# EAGLE design powerattempt9wout (EAGLE 6.1)
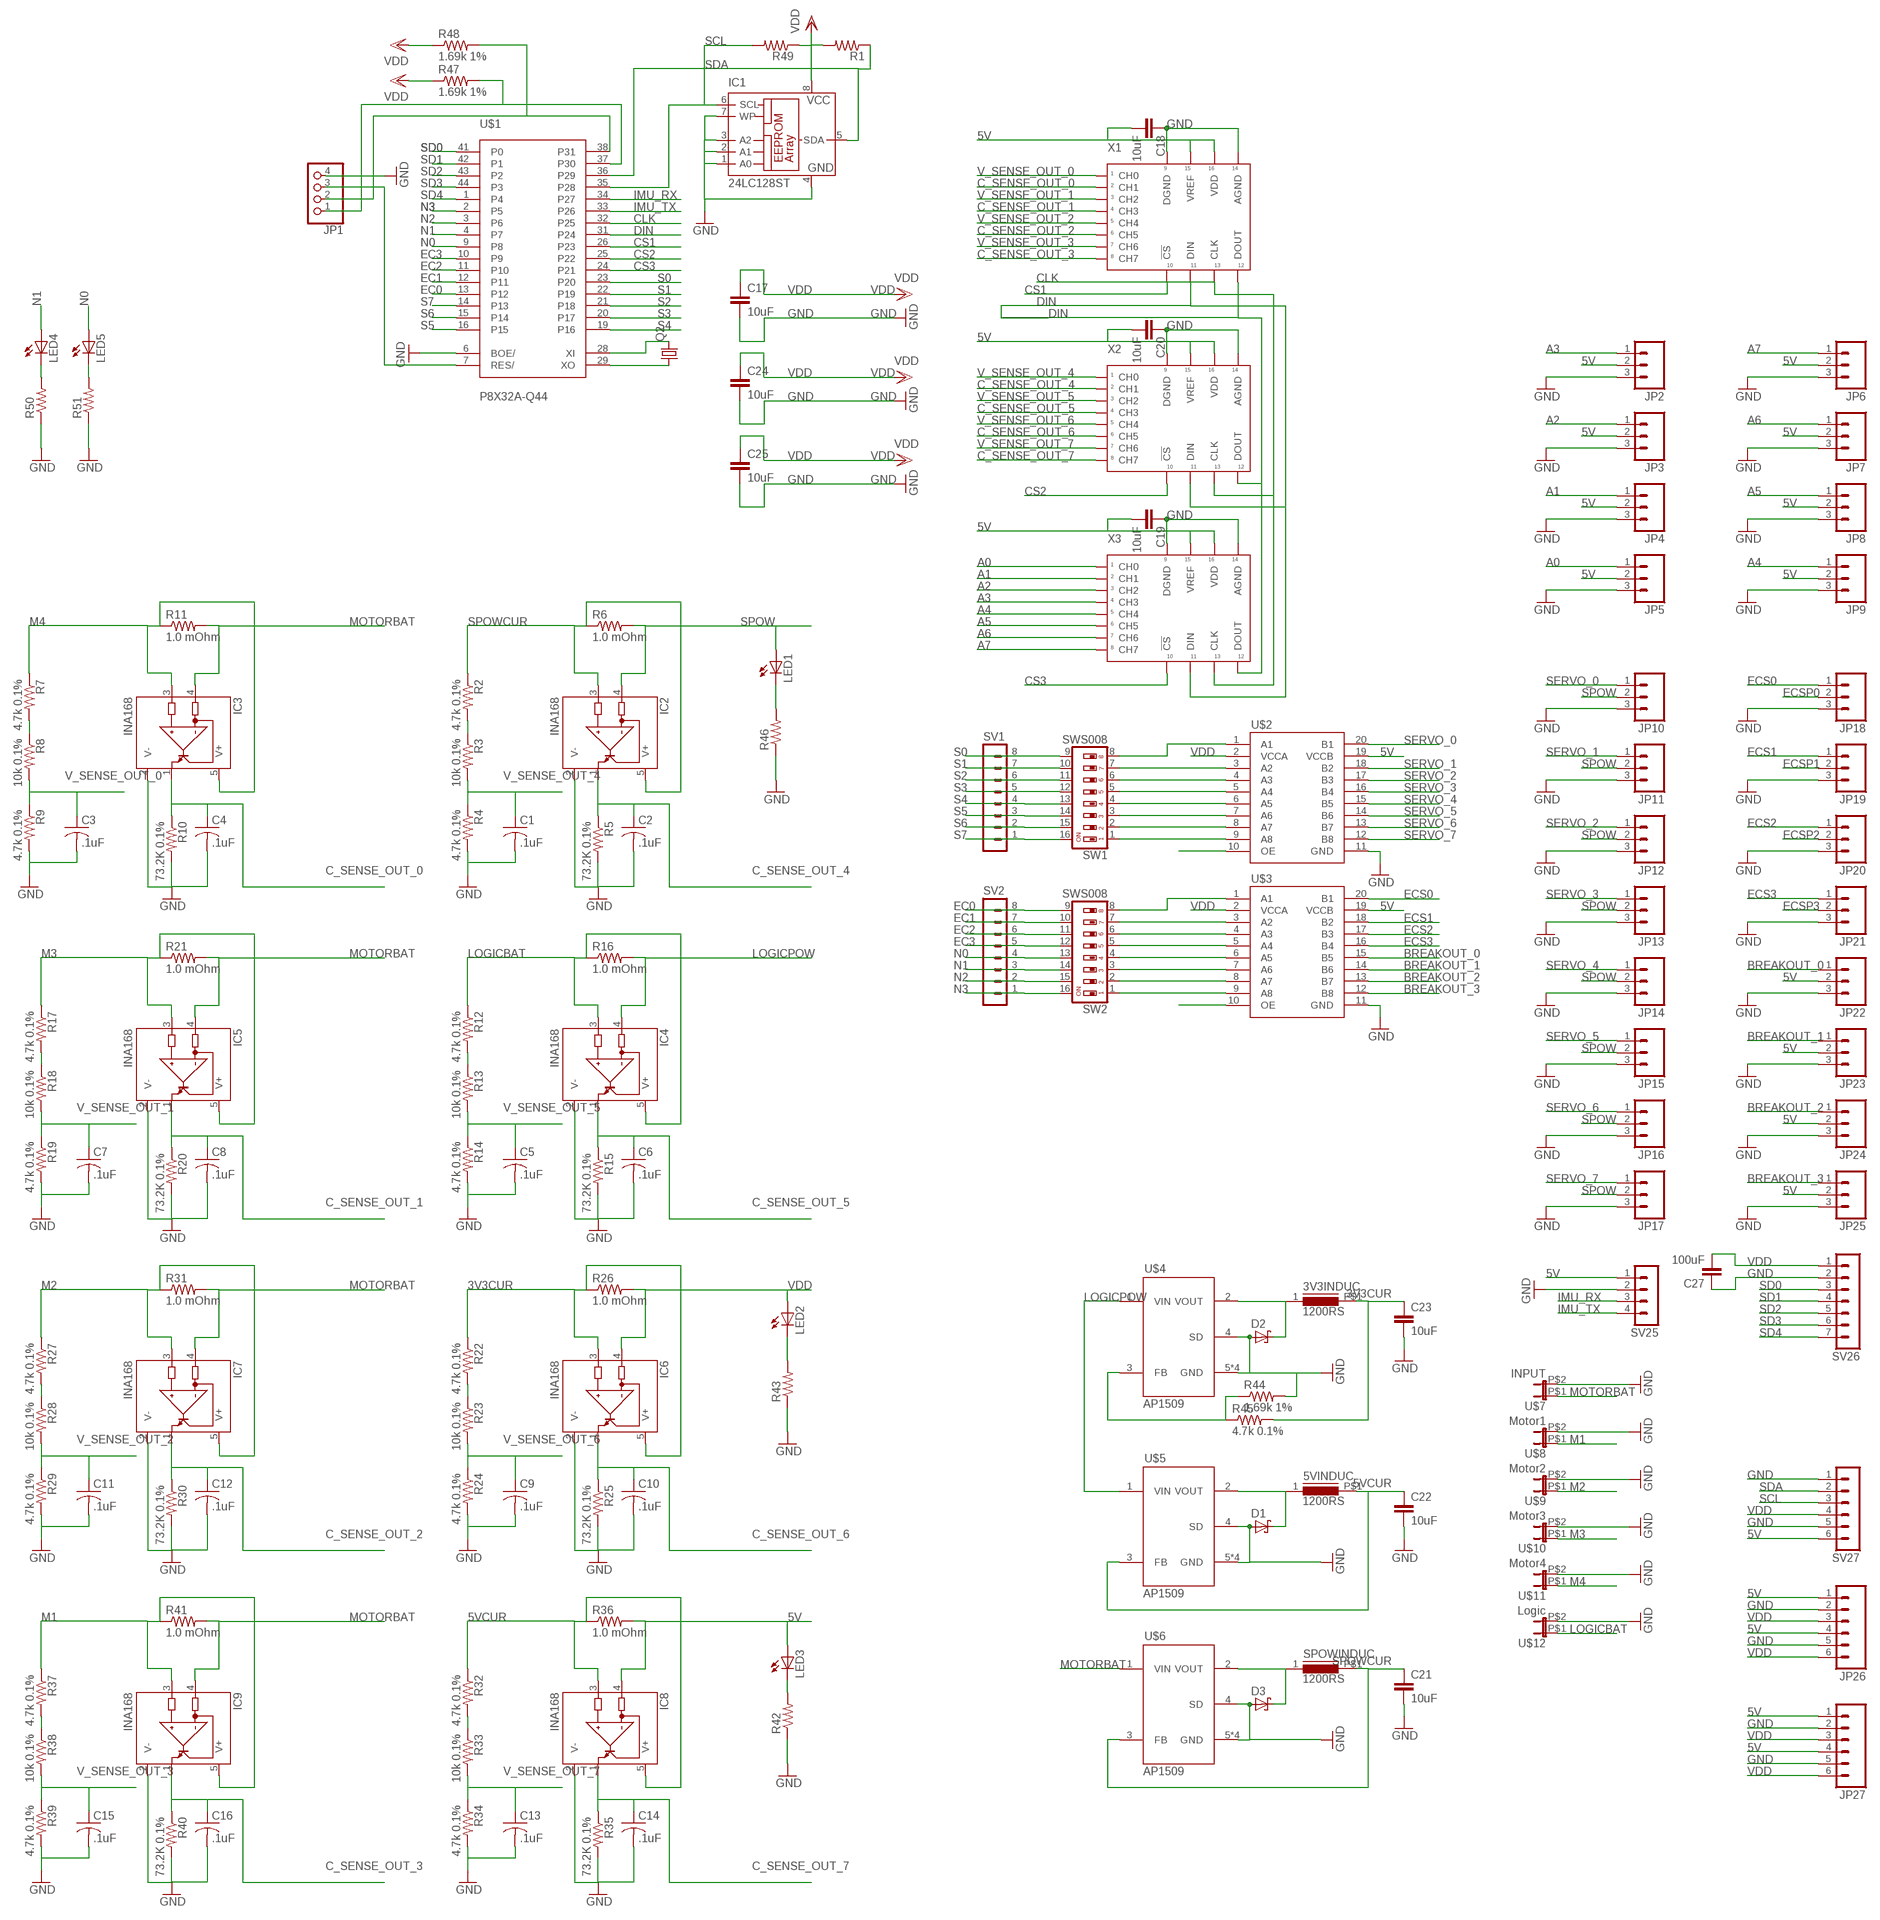
[diagram p0: schematic, sheet 1]

## Parts
3V3INDUC  1200RS  [1200RS]
5VINDUC  1200RS  [1200RS]
C1  .1uF  C-USC0805  [C0805]
C2  .1uF  C-USC0805  [C0805]
C3  .1uF  C-USC0805  [C0805]
C4  .1uF  C-USC0805  [C0805]
C5  .1uF  C-USC0805  [C0805]
C6  .1uF  C-USC0805  [C0805]
C7  .1uF  C-USC0805  [C0805]
C8  .1uF  C-USC0805  [C0805]
C9  .1uF  C-USC0805  [C0805]
C10  .1uF  C-USC0805  [C0805]
C11  .1uF  C-USC0805  [C0805]
C12  .1uF  C-USC0805  [C0805]
C13  .1uF  C-USC0805  [C0805]
C14  .1uF  C-USC0805  [C0805]
C15  .1uF  C-USC0805  [C0805]
C16  .1uF  C-USC0805  [C0805]
C17  10uF  CAP1206  [1206]
C18  10uF  CAP1206  [1206]
C19  10uF  CAP1206  [1206]
C20  10uF  CAP1206  [1206]
C21  10uF  CAP1206  [1206]
C22  10uF  CAP1206  [1206]
C23  10uF  CAP1206  [1206]
C24  10uF  CAP1206  [1206]
C25  10uF  CAP1206  [1206]
C27  100uF  CAP1206  [1206]
D1  SCHOTTKY-DIODESMD  [SMB]
D2  SCHOTTKY-DIODESMD  [SMB]
D3  SCHOTTKY-DIODESMD  [SMB]
IC1  24LC128ST  [TSSOP8]
IC2  INA168  [SOT23-5]
IC3  INA168  [SOT23-5]
IC4  INA168  [SOT23-5]
IC5  INA168  [SOT23-5]
IC6  INA168  [SOT23-5]
IC7  INA168  [SOT23-5]
IC8  INA168  [SOT23-5]
IC9  INA168  [SOT23-5]
JP1  PINHD-1X4/90  [1X04/90]
JP2  M03PTH  [1X03]
JP3  M03PTH  [1X03]
JP4  M03PTH  [1X03]
JP5  M03PTH  [1X03]
JP6  M03PTH  [1X03]
JP7  M03PTH  [1X03]
JP8  M03PTH  [1X03]
JP9  M03PTH  [1X03]
JP10  M03PTH  [1X03]
JP11  M03PTH  [1X03]
JP12  M03PTH  [1X03]
JP13  M03PTH  [1X03]
JP14  M03PTH  [1X03]
JP15  M03PTH  [1X03]
JP16  M03PTH  [1X03]
JP17  M03PTH  [1X03]
JP18  M03PTH  [1X03]
JP19  M03PTH  [1X03]
JP20  M03PTH  [1X03]
JP21  M03PTH  [1X03]
JP22  M03PTH  [1X03]
JP23  M03PTH  [1X03]
JP24  M03PTH  [1X03]
JP25  M03PTH  [1X03]
JP26  M06SIP  [1X06]
JP27  M06SIP  [1X06]
LED1  LEDSML0805  [SML0805]
LED2  LEDSML0805  [SML0805]
LED3  LEDSML0805  [SML0805]
LED4  LEDSML0805  [SML0805]
LED5  LEDSML0805  [SML0805]
Q2  CRYSTALHC49S  [HC49/S]
R1  R-US_M0805  [M0805]
R2  4.7k 0.1%  RESISTOR0805-RES  [0805]
R3  10k 0.1%  RESISTOR0805-RES  [0805]
R4  4.7k 0.1%  RESISTOR0805-RES  [0805]
R5  73.2K 0.1%  RESISTOR0805-RES  [0805]
R6  1.0 mOhm  LVK25  [LVK25]
R7  4.7k 0.1%  RESISTOR0805-RES  [0805]
R8  10k 0.1%  RESISTOR0805-RES  [0805]
R9  4.7k 0.1%  RESISTOR0805-RES  [0805]
R10  73.2K 0.1%  RESISTOR0805-RES  [0805]
R11  1.0 mOhm  LVK25  [LVK25]
R12  4.7k 0.1%  RESISTOR0805-RES  [0805]
R13  10k 0.1%  RESISTOR0805-RES  [0805]
R14  4.7k 0.1%  RESISTOR0805-RES  [0805]
R15  73.2K 0.1%  RESISTOR0805-RES  [0805]
R16  1.0 mOhm  LVK25  [LVK25]
R17  4.7k 0.1%  RESISTOR0805-RES  [0805]
R18  10k 0.1%  RESISTOR0805-RES  [0805]
R19  4.7k 0.1%  RESISTOR0805-RES  [0805]
R20  73.2K 0.1%  RESISTOR0805-RES  [0805]
R21  1.0 mOhm  LVK25  [LVK25]
R22  4.7k 0.1%  RESISTOR0805-RES  [0805]
R23  10k 0.1%  RESISTOR0805-RES  [0805]
R24  4.7k 0.1%  RESISTOR0805-RES  [0805]
R25  73.2K 0.1%  RESISTOR0805-RES  [0805]
R26  1.0 mOhm  LVK25  [LVK25]
R27  4.7k 0.1%  RESISTOR0805-RES  [0805]
R28  10k 0.1%  RESISTOR0805-RES  [0805]
R29  4.7k 0.1%  RESISTOR0805-RES  [0805]
R30  73.2K 0.1%  RESISTOR0805-RES  [0805]
R31  1.0 mOhm  LVK25  [LVK25]
R32  4.7k 0.1%  RESISTOR0805-RES  [0805]
R33  10k 0.1%  RESISTOR0805-RES  [0805]
R34  4.7k 0.1%  RESISTOR0805-RES  [0805]
R35  73.2K 0.1%  RESISTOR0805-RES  [0805]
R36  1.0 mOhm  LVK25  [LVK25]
R37  4.7k 0.1%  RESISTOR0805-RES  [0805]
R38  10k 0.1%  RESISTOR0805-RES  [0805]
R39  4.7k 0.1%  RESISTOR0805-RES  [0805]
R40  73.2K 0.1%  RESISTOR0805-RES  [0805]
R41  1.0 mOhm  LVK25  [LVK25]
R42  RESISTOR0805-RES  [0805]
R43  RESISTOR0805-RES  [0805]
R44  1.69k 1%  RESISTOR0805-RES  [0805]
R45  4.7k 0.1%  RESISTOR0805-RES  [0805]
R46  RESISTOR0805-RES  [0805]
R47  1.69k 1%  RESISTOR0805-RES  [0805]
R48  1.69k 1%  RESISTOR0805-RES  [0805]
R49  R-US_M0805  [M0805]
R50  RESISTOR0805-RES  [0805]
R51  RESISTOR0805-RES  [0805]
SPOWINDUC  1200RS  [1200RS]
SV1  MA08-1  [MA08-1]
SV2  MA08-1  [MA08-1]
SV25  MA04-1  [MA04-1]
SV26  MA07-1  [MA07-1]
SV27  MA06-1  [MA06-1]
SW1  SWS008  [SMS-008]
SW2  SWS008  [SMS-008]
U$1  P8X32A-Q44  [P8X32A-Q44]
U$2  TXB0108PWR  [TSSOP20]
U$3  TXB0108PWR  [TSSOP20]
U$4  AP1509  [SO08]
U$5  AP1509  [SO08]
U$6  AP1509  [SO08]
U$7  INPUT  DEANSDEANS  [DEANS]
U$8  Motor1  DEANSDEANS  [DEANS]
U$9  Motor2  DEANSDEANS  [DEANS]
U$10  Motor3  DEANSDEANS  [DEANS]
U$11  Motor4  DEANSDEANS  [DEANS]
U$12  Logic  DEANSDEANS  [DEANS]
X1  21298ESMD  [PDIP16]
X2  21298ESMD  [PDIP16]
X3  21298ESMD  [PDIP16]

## Nets
3V3CUR: 3V3INDUC.P$1 C23.1 IC6.3(IN+) IC6.5(V+) R22.1 R26.P$1 R45.2
5V: C18.2 C19.2 C20.2 IC8.4(IN-) JP2.2 JP3.2 JP4.2 JP5.2 JP6.2 JP7.2 JP8.2 JP9.2 JP22.2 JP23.2 JP24.2 JP25.2 JP26.1 JP26.4 JP27.1 JP27.4 LED3.A R36.P$5 SV25.1 SV27.6 U$2.19(VCCB) U$3.19(VCCB) X1.P$15(VREF) X1.P$16(VDD) X2.P$15(VREF) X2.P$16(VDD) X3.P$15(VREF) X3.P$16(VDD)
5VCUR: 5VINDUC.P$1 C22.1 IC8.3(IN+) IC8.5(V+) R32.1 R36.P$1 U$5.3(FB)
A0: JP5.1 X3.P$1(CH0)
A1: JP4.1 X3.P$2(CH1)
A2: JP3.1 X3.P$3(CH2)
A3: JP2.1 X3.P$4(CH3)
A4: JP9.1 X3.P$5(CH4)
A5: JP8.1 X3.P$6(CH5)
A6: JP7.1 X3.P$7(CH6)
A7: JP6.1 X3.P$8(CH7)
BREAKOUT_0: JP22.1 U$3.15(B5)
BREAKOUT_1: JP23.1 U$3.14(B6)
BREAKOUT_2: JP24.1 U$3.13(B7)
BREAKOUT_3: JP25.1 U$3.12(B8)
C_SENSE_OUT_0: C4.1 IC3.1(OUT) R10.1 X1.P$2(CH1)
C_SENSE_OUT_1: C8.1 IC5.1(OUT) R20.1 X1.P$4(CH3)
C_SENSE_OUT_2: C12.1 IC7.1(OUT) R30.1 X1.P$6(CH5)
C_SENSE_OUT_3: C16.1 IC9.1(OUT) R40.1 X1.P$8(CH7)
C_SENSE_OUT_4: C2.1 IC2.1(OUT) R5.1 X2.P$2(CH1)
C_SENSE_OUT_5: C6.1 IC4.1(OUT) R15.1 X2.P$4(CH3)
C_SENSE_OUT_6: C10.1 IC6.1(OUT) R25.1 X2.P$6(CH5)
C_SENSE_OUT_7: C14.1 IC8.1(OUT) R35.1 X2.P$8(CH7)
CLK: U$1.32(P25) X1.P$13(CLK) X2.P$13(CLK) X3.P$13(CLK)
CS1: U$1.26(P23) X1.P$10(!CS)
CS2: U$1.25(P22) X2.P$10(!CS)
CS3: U$1.24(P21) X3.P$10(!CS)
DIN: U$1.31(P24) X1.P$11(DIN) X1.P$12(DOUT) X2.P$11(DIN) X2.P$12(DOUT) X3.P$11(DIN) X3.P$12(DOUT)
EC0: SV2.8 SW2.9 U$1.13(P12)
EC1: SV2.7 SW2.10 U$1.12(P11)
EC2: SV2.6 SW2.11 U$1.11(P10)
EC3: SV2.5 SW2.12 U$1.10(P9)
ECS0: JP18.1 U$3.20(B1)
ECS1: JP19.1 U$3.18(B2)
ECS2: JP20.1 U$3.17(B3)
ECS3: JP21.1 U$3.16(B4)
ECSP0: JP18.2
ECSP1: JP19.2
ECSP2: JP20.2
ECSP3: JP21.2
GND: C1.2 C2.2 C3.2 C4.2 C5.2 C6.2 C7.2 C8.2 C9.2 C10.2 C11.2 C12.2 C13.2 C14.2 C15.2 C16.2 C17.2 C18.1 C19.1 C20.1 C21.2 C22.2 C23.2 C24.2 C25.2 C27.1 D1.A D2.A D3.A IC1.1(A0) IC1.2(A1) IC1.3(A2) IC1.4(GND) IC1.7(WP) IC2.2(V-) IC3.2(V-) IC4.2(V-) IC5.2(V-) IC6.2(V-) IC7.2(V-) IC8.2(V-) IC9.2(V-) JP1.4 JP2.3 JP3.3 JP4.3 JP5.3 JP6.3 JP7.3 JP8.3 JP9.3 JP10.3 JP11.3 JP12.3 JP13.3 JP14.3 JP15.3 JP16.3 JP17.3 JP18.3 JP19.3 JP20.3 JP21.3 JP22.3 JP23.3 JP24.3 JP25.3 JP26.2 JP26.5 JP27.2 JP27.5 R4.2 R5.2 R9.2 R10.2 R14.2 R15.2 R19.2 R20.2 R24.2 R25.2 R29.2 R30.2 R34.2 R35.2 R39.2 R40.2 R42.1 R43.1 R44.2 R46.1 R50.1 R51.1 SV25.2 SV26.2 SV27.1 SV27.5 U$1.6(BOE/) U$2.11(GND) U$3.11(GND) U$4.4(SD) U$4.5(GND) U$4.6(GND) U$4.7(GND) U$4.8(GND) U$5.4(SD) U$5.5(GND) U$5.6(GND) U$5.7(GND) U$5.8(GND) U$6.4(SD) U$6.5(GND) U$6.6(GND) U$6.7(GND) U$6.8(GND) U$7.P$2 U$8.P$2 U$9.P$2 U$10.P$2 U$11.P$2 U$12.P$2 X1.P$9(DGND) X1.P$14(AGND) X2.P$9(DGND) X2.P$14(AGND) X3.P$9(DGND) X3.P$14(AGND)
IMU_RX: SV25.3 U$1.34(P27)
IMU_TX: SV25.4 U$1.33(P26)
LOGICBAT: IC4.3(IN+) IC4.5(V+) R12.1 R16.P$1 U$12.P$1
LOGICPOW: IC4.4(IN-) R16.P$5 U$4.1(VIN) U$5.1(VIN)
M1: IC9.3(IN+) IC9.5(V+) R37.1 R41.P$1 U$8.P$1
M2: IC7.3(IN+) IC7.5(V+) R27.1 R31.P$1 U$9.P$1
M3: IC5.3(IN+) IC5.5(V+) R17.1 R21.P$1 U$10.P$1
M4: IC3.3(IN+) IC3.5(V+) R7.1 R11.P$1 U$11.P$1
MOTORBAT: IC3.4(IN-) IC5.4(IN-) IC7.4(IN-) IC9.4(IN-) R11.P$5 R21.P$5 R31.P$5 R41.P$5 U$6.1(VIN) U$7.P$1
N0: LED5.A SV2.4 SW2.13 U$1.9(P8)
N1: LED4.A SV2.3 SW2.14 U$1.4(P7)
N2: SV2.2 SW2.15 U$1.3(P6)
N3: SV2.1 SW2.16 U$1.2(P5)
N$1: JP1.1 R47.2 U$1.37(P30)
N$2: JP1.2 R48.2 U$1.38(P31)
N$3: LED4.C R50.2
N$4: LED5.C R51.2
N$5: Q2.1 U$1.29(XO)
N$6: Q2.2 U$1.28(XI)
N$7: JP1.3 U$1.7(RES/)
N$12: R2.2 R3.1
N$13: R7.2 R8.1
N$16: R12.2 R13.1
N$19: R17.2 R18.1
N$22: R22.2 R23.1
N$25: R27.2 R28.1
N$28: R32.2 R33.1
N$31: R37.2 R38.1
N$32: SW1.8 U$2.1(A1)
N$33: SW1.7 U$2.3(A2)
N$34: SW1.6 U$2.4(A3)
N$35: SW1.5 U$2.5(A4)
N$36: SW1.4 U$2.6(A5)
N$37: SW1.3 U$2.7(A6)
N$38: SW1.2 U$2.8(A7)
N$39: SW1.1 U$2.9(A8)
N$40: U$2.10(OE)
N$41: SW2.8 U$3.1(A1)
N$42: SW2.7 U$3.3(A2)
N$43: SW2.6 U$3.4(A3)
N$44: SW2.5 U$3.5(A4)
N$45: SW2.4 U$3.6(A5)
N$46: SW2.3 U$3.7(A6)
N$47: SW2.2 U$3.8(A7)
N$48: SW2.1 U$3.9(A8)
N$49: U$3.10(OE)
N$71: LED1.C R46.2
N$72: LED2.C R43.2
N$73: LED3.C R42.2
N$77: 3V3INDUC.1 D2.C U$4.2(VOUT)
N$78: 5VINDUC.1 D1.C U$5.2(VOUT)
N$79: D3.C SPOWINDUC.1 U$6.2(VOUT)
N$83: R44.1 R45.1 U$4.3(FB)
S0: SV1.8 SW1.9 U$1.23(P20)
S1: SV1.7 SW1.10 U$1.22(P19)
S2: SV1.6 SW1.11 U$1.21(P18)
S3: SV1.5 SW1.12 U$1.20(P17)
S4: SV1.4 SW1.13 U$1.19(P16)
S5: SV1.3 SW1.14 U$1.16(P15)
S6: SV1.2 SW1.15 U$1.15(P14)
S7: SV1.1 SW1.16 U$1.14(P13)
SCL: IC1.6(SCL) R49.2 SV27.3 U$1.35(P28)
SD0: SV26.3 U$1.41(P0)
SD1: SV26.4 U$1.42(P1)
SD2: SV26.5 U$1.43(P2)
SD3: SV26.6 U$1.44(P3)
SD4: SV26.7 U$1.1(P4)
SDA: IC1.5(SDA) R1.1 SV27.2 U$1.36(P29)
SERVO_0: JP10.1 U$2.20(B1)
SERVO_1: JP11.1 U$2.18(B2)
SERVO_2: JP12.1 U$2.17(B3)
SERVO_3: JP13.1 U$2.16(B4)
SERVO_4: JP14.1 U$2.15(B5)
SERVO_5: JP15.1 U$2.14(B6)
SERVO_6: JP16.1 U$2.13(B7)
SERVO_7: JP17.1 U$2.12(B8)
SPOW: IC2.4(IN-) JP10.2 JP11.2 JP12.2 JP13.2 JP14.2 JP15.2 JP16.2 JP17.2 LED1.A R6.P$5
SPOWCUR: C21.1 IC2.3(IN+) IC2.5(V+) R2.1 R6.P$1 SPOWINDUC.P$1 U$6.3(FB)
V_SENSE_OUT_0: C3.1 R8.2 R9.1 X1.P$1(CH0)
V_SENSE_OUT_1: C7.1 R18.2 R19.1 X1.P$3(CH2)
V_SENSE_OUT_2: C11.1 R28.2 R29.1 X1.P$5(CH4)
V_SENSE_OUT_3: C15.1 R38.2 R39.1 X1.P$7(CH6)
V_SENSE_OUT_4: C1.1 R3.2 R4.1 X2.P$1(CH0)
V_SENSE_OUT_5: C5.1 R13.2 R14.1 X2.P$3(CH2)
V_SENSE_OUT_6: C9.1 R23.2 R24.1 X2.P$5(CH4)
V_SENSE_OUT_7: C13.1 R33.2 R34.1 X2.P$7(CH6)
VDD: C17.1 C24.1 C25.1 C27.2 IC1.8(VCC) IC6.4(IN-) JP26.3 JP26.6 JP27.3 JP27.6 LED2.A R1.2 R26.P$5 R47.1 R48.1 R49.1 SV26.1 SV27.4 U$2.2(VCCA) U$3.2(VCCA)

## Power pins joined to a net without a drawn wire
GND: U$1.5(GND) U$1.17(GND) U$1.27(GND) U$1.39(GND)
VDD: U$1.8(VDD) U$1.18(VDD) U$1.30(VDD) U$1.40(VDD)

## Library data of the parts
3V3INDUC 5VINDUC SPOWINDUC = inductors:1200RS
C1-C16 = resistor:C-US: CAPACITOR, American symbol
C17-C25 C27 = SparkFun:CAP: Capacitor Standard 0603 ceramic capacitor, and 0.1" leaded capacitor.
D1-D3 = diode:SCHOTTKY-DIODE: Schottky Diode
IC1 = microchip:24*: Serial EEPROM I2C; MF: MICROCHIP; MPN: 24LC128-I/ST; OC_FARNELL: 1296573; OC_NEWARK: 62K0578
IC2-IC9 = burr-brown:INA168: High-Side Measurement Current Shunt Monitor; MF: TEXAS INSTRUMENTS; MPN: INA168NA/250; OC_FARNELL: 4375737; OC_NEWARK: 35C1744
JP1 = pinhead:PINHD-1X4: PIN HEADER
JP2-JP25 = SparkFun:M03: Header 3 Standard 3-pin 0.1" header. Use with straight break away headers (SKU : PRT-00116), right angle break away headers (PRT-00553), swiss pins (PRT-00743), machine pins (PRT-00117), and female headers (PRT-00115). Molex polarized connector foot print use with SKU : PRT-08232 with associated crimp pins and housings.
JP26 JP27 = SparkFun:M06: Header 6 Standard 6-pin 0.1" header. Use with straight break away headers (SKU : PRT-00116), right angle break away headers (PRT-00553), swiss pins (PRT-00743), machine pins (PRT-00117), and female headers (PRT-00115). Molex polarized connector foot print use with SKU : PRT-08094 with associated crimp pins and housings. NOTES ON THE VARIANTS LOCK and LOCK_LONGPADS... This footprint was designed to help hold the alignment of a through-hole component (i.e. 6-pin header) while soldering it into place. You may notice that each hole has been shifted either up or down by 0.005 of an inch from it's more standard position (which is a perfectly straight line). This slight alteration caused the pins (the squares in the middle) to touch the edges of the holes. Because they are alternating, it causes a "brace" to hold the component in place. 0.005 has proven to be the perfect amount of "off-center" position when using our standard breakaway headers. Although looks a little odd when you look at the bare footprint, once you have a header in there, the alteration is very hard to notice. Also, if you push a header all the way into place, it is covered up entirely on the bottom side. This idea of altering the position of holes to aid alignment will be further integrated into the Sparkfun Library for other footprints. It can help hold any component with 3 or more connection pins.
LED1-LED5 = led:LED: LED OSRAM: - CHIPLED LG R971, LG N971, LY N971, LG Q971, LY Q971, LO R971, LY R971 LH N974, LH R974 LS Q976, LO Q976, LY Q976 LO Q996 - Hyper CHIPLED LW Q18S LB Q993, LB Q99A, LB R99A - SideLED LS A670, LO A670, LY A670, LG A670, LP A670 LB A673, LV A673, LT A673, LW A673 LH A674 LY A675 LS A676, LA A676, LO A676, LY A676, LW A676 LS A679, LY A679, LG A679 - Hyper Micro SIDELED® LS Y876, LA Y876, LO Y876, LY Y876 LT Y87S - SmartLED LW L88C, LW L88S LB L89C, LB L89S, LG L890 LS L89K, LO L89K, LY L89K LS L896, LA L896, LO L896, LY L896 - TOPLED LS T670, LO T670, LY T670, LG T670, LP T670 LSG T670, LSP T670, LSY T670, LOP T670, LYG T670 LG T671, LOG T671, LSG T671 LB T673, LV T673, LT T673, LW T673 LH T674 LS T676, LA T676, LO T676, LY T676, LB T676, LH T676, LSB T676, LW T676 LB T67C, LV T67C, LT T67C, LS T67K, LO T67K, LY T67K, LW E67C LS E67B, LA E67B, LO E67B, LY E67B, LB E67C, LV E67C, LT E67C LW T67C LS T679, LY T679, LG T679 LS T770, LO T770, LY T770, LG T770, LP T770 LB T773, LV T773, LT T773, LW T773 LH T774 LS E675, LA E675, LY E675, LS T675 LS T776, LA T776, LO T776, LY T776, LB T776 LHGB T686 LT T68C, LB T68C - Hyper Mini TOPLED® LB M676 - Mini TOPLED Santana® LG M470 LS M47K, LO M47K, LY M47K Source: http://www.osram.convergy.de LUXEON: - LUMILED® LXK2-PW12-R00, LXK2-PW12-S00, LXK2-PW14-U00, LXK2-PW14-V00 LXK2-PM12-R00, LXK2-PM12-S00, LXK2-PM14-U00 LXK2-PE12-Q00, LXK2-PE12-R00, LXK2-PE12-S00, LXK2-PE14-T00, LXK2-PE14-U00 LXK2-PB12-K00, LXK2-PB12-L00, LXK2-PB12-M00, LXK2-PB14-N00, LXK2-PB14-P00, LXK2-PB14-Q00 LXK2-PR12-L00, LXK2-PR12-M00, LXK2-PR14-Q00, LXK2-PR14-R00 LXK2-PD12-Q00, LXK2-PD12-R00, LXK2-PD12-S00 LXK2-PH12-R00, LXK2-PH12-S00 LXK2-PL12-P00, LXK2-PL12-Q00, LXK2-PL12-R00 Source: www.luxeon.com KINGBRIGHT: KA-3528ASYC Source: www.kingbright.com
Q2 = crystal:CRYSTAL: CRYSTAL; OC_FARNELL: 1667008; OC_NEWARK: unknown
R1 R49 = resistor:R-US_: RESISTOR, American symbol
R2-R5 R7-R10 R12-R15 R17-R20 R22-R25 R27-R30 R32-R35 R37-R40 R42-R48 R50 R51 = SparkFun:RESISTOR: Resistor Basic schematic elements and footprints for 0603, 1206, and PTH resistors.
R6 R11 R16 R21 R26 R31 R36 R41 = SparkFun:LVK25
SV1 SV2 = con-lstb:MA08-1: PIN HEADER; OC_FARNELL: unknown; OC_NEWARK: unknown
SV25 = con-lstb:MA04-1: PIN HEADER; OC_FARNELL: unknown; OC_NEWARK: unknown
SV26 = con-lstb:MA07-1: PIN HEADER; OC_FARNELL: unknown; OC_NEWARK: unknown
SV27 = con-lstb:MA06-1: PIN HEADER; OC_FARNELL: unknown; OC_NEWARK: unknown
SW1 SW2 = smd-special:SWS008: SMD Dip Switch 8 pol.
U$1 = parallax_propeller:P8X32A-Q44
U$2 U$3 = SparkFun:TXB0108PWR: Logic level shifter. TSSOP20
U$4-U$6 = SparkFun:AP1509
U$7-U$12 = SparkFun:DEANS
X1-X3 = Microchip (2):21298E

## Board
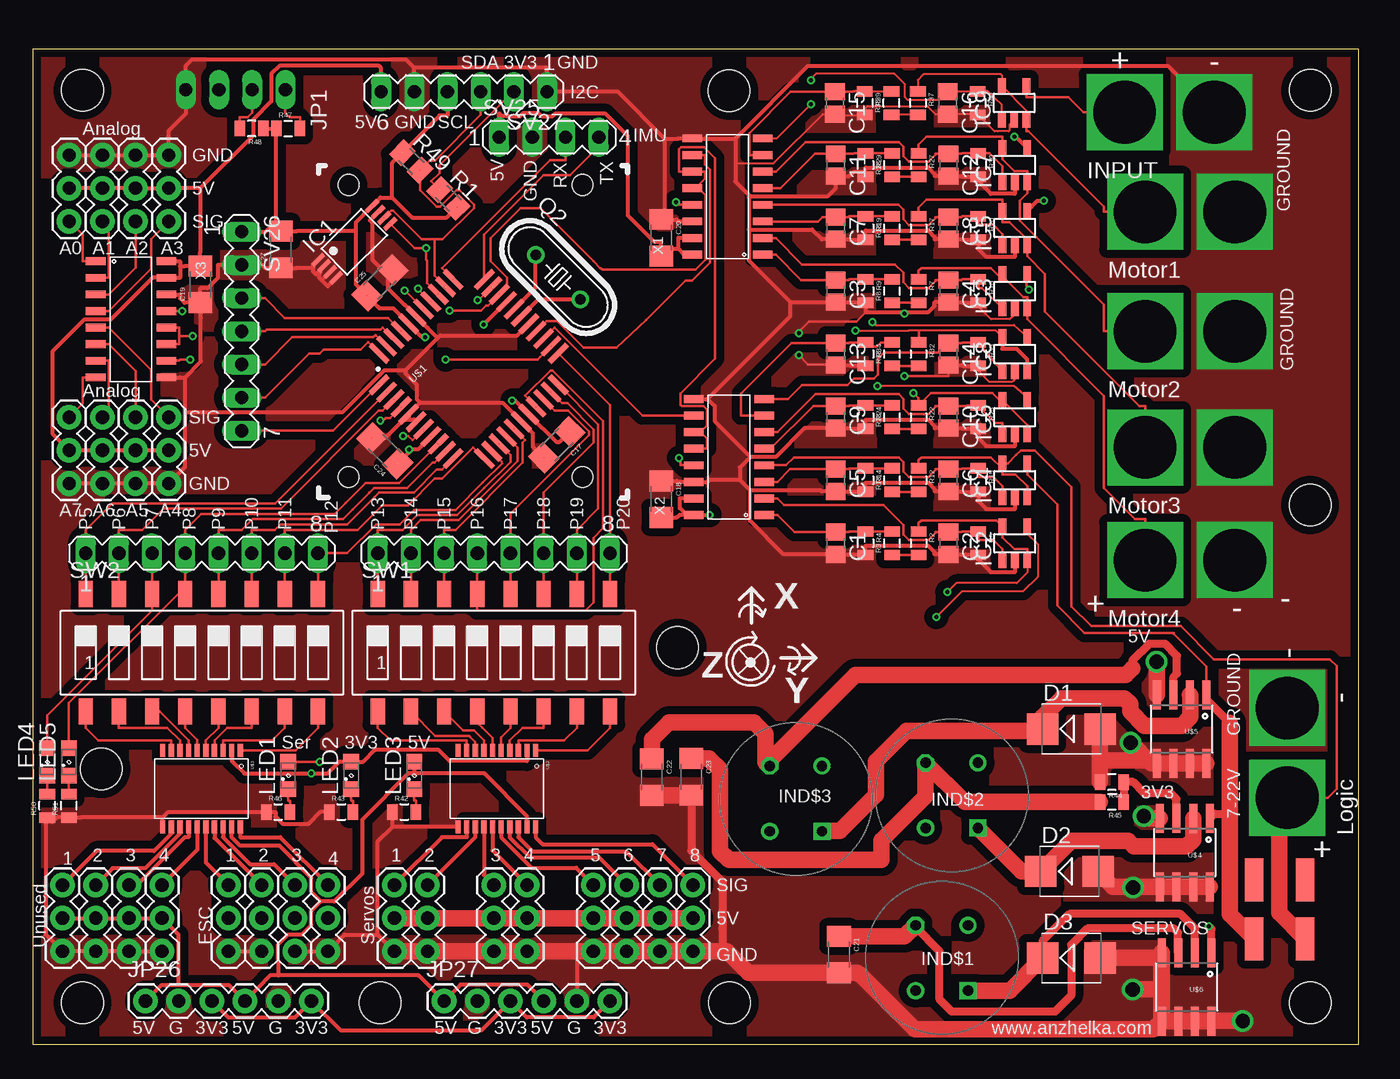
[diagram p1: board, top side]
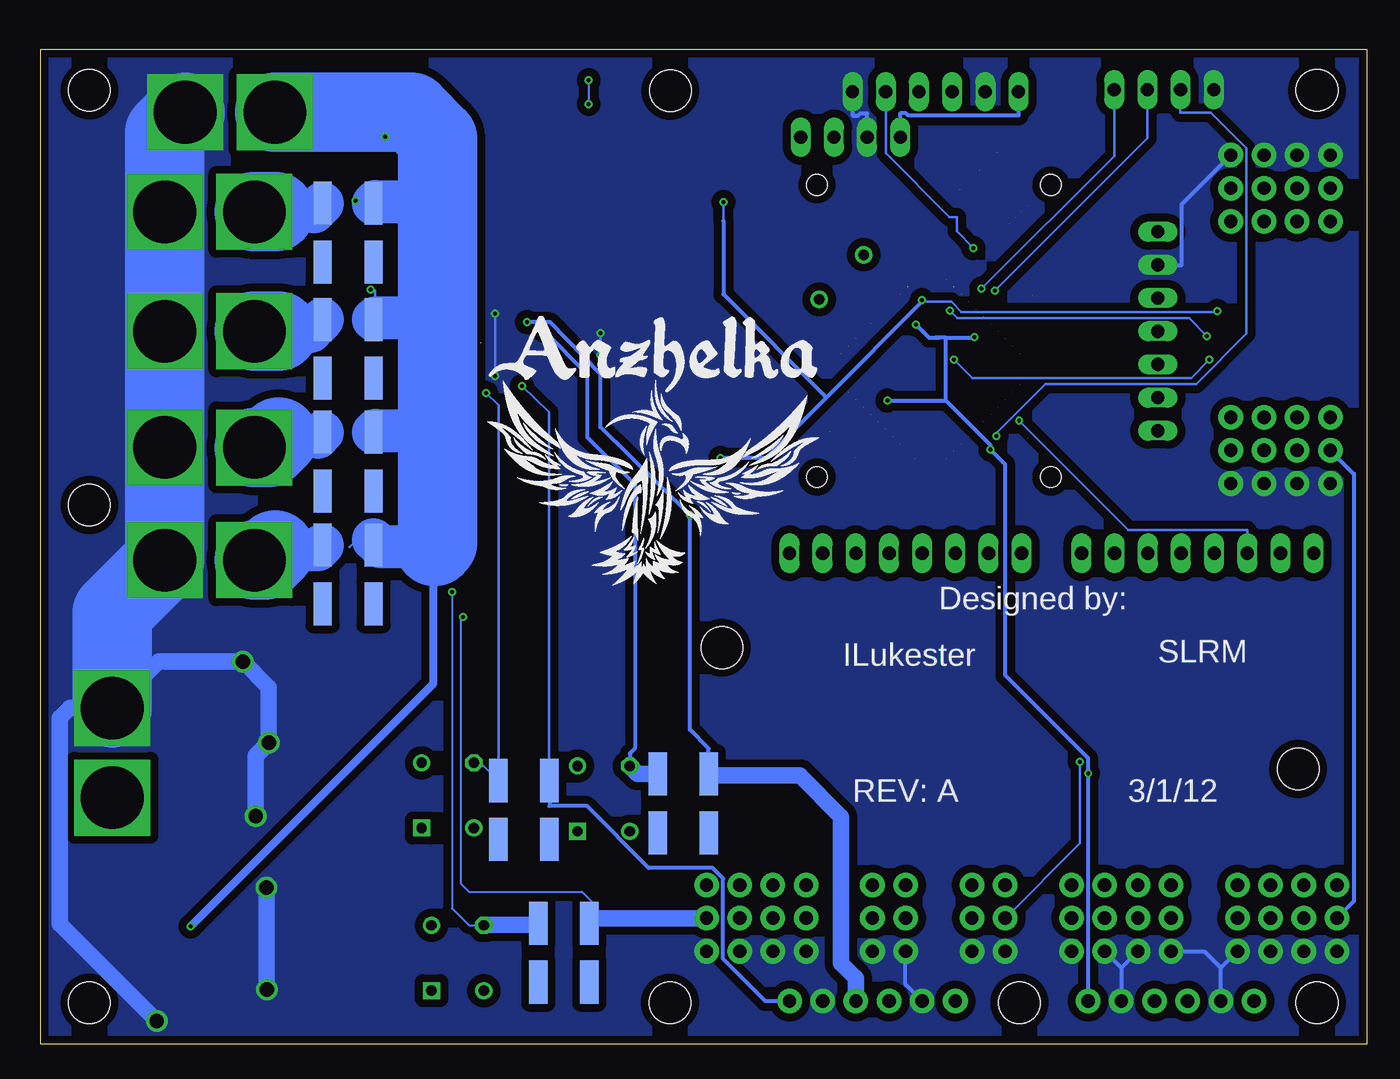
[diagram p2: board, bottom side, seen from below]

Size 101.52 x 76.19 mm. Coordinates in mm from the lower left corner, seen from the top.
Outline: 0,0 101.52,0 101.52,76.19 0,76.19 0,0
Copper layers (1*16): Top 0.035mm / dielectric 1.5mm / Bottom 0.035mm
Design rules: minimum track width 6mil, minimum drill 12mil, track to track 6mil, track to pad 6mil, pad to pad 6mil, via to via 6mil, smd to smd 0mil, copper to edge 10mil, drill to drill 10mil, minimum pad ring 10mil, minimum via ring 6mil, stop-mask expansion 2mil, vias tented up to drill 100mil, thermal gap 10mil
Holes 1.6 mm at 24.19,43.43 24.19,65.79 42.09,43.43 42.09,65.79
Holes 3.2 mm at 3.81,73.03 97.79,73.03 97.79,3.17 3.81,3.17 53.34,3.17 53.31,73 26.59,3.17 5.26,21.08 49.38,30.35 97.79,41.27

### Footprints (pad centres in the part's own frame; a part is rotated, then mirrored left to right if it is on the bottom)
1200RS = drill 0.8 square: 1 -2,2.5 | drill 0.8: 2 -2,-2.5; 4 2,2.5 | drill 0.8 octagon: P$1 2,-2.5
C0805 = smd 1.3 x 1.5: 1 -0.85,0; 2 0.85,0
1206 = smd 1.6 x 1.8: 1 -1.4,0; 2 1.4,0
SMB = smd 2.4 x 2.4: A 2.2,0; C -2.2,0
TSSOP8 = smd 0.35 x 1.2: 1 -0.975,-2.925; 2 -0.325,-2.925; 3 0.325,-2.925; 4 0.975,-2.925; 5 0.975,2.925; 6 0.325,2.925; 7 -0.325,2.925; 8 -0.975,2.925
SOT23-5 = smd 0.6 x 1.2: 1 -0.95,-1.306; 2 0,-1.306; 3 0.95,-1.306; 4 0.95,1.306; 5 -0.95,1.306
1X04/90 = drill 1.016 long: 1 -3.81,-3.81; 2 -1.27,-3.81; 3 1.27,-3.81; 4 3.81,-3.81
1X03 = drill 1.016 pad 1.88: 1 0,0; 2 2.54,0; 3 5.08,0
1X06 = drill 1.016 pad 1.88: 1 0,0; 2 2.54,0; 3 5.08,0; 4 7.62,0; 5 10.16,0; 6 12.7,0
SML0805 = smd 1.2 x 1.2: A 1.05,0; C -1.05,0
HC49/S = drill 0.813: 1 -2.413,0; 2 2.413,0
M0805 = smd 1.3 x 1.6: 1 -0.95,0; 2 0.95,0
0805 = smd 0.8 x 1.2: 1 -0.9,0; 2 0.9,0
LVK25 = smd 1.4 x 3.3: P$1 -1.96,2.15; P$5 1.94,2.15; P$10 1.94,-2.35; P$11 -1.96,-2.35
MA08-1 = drill 1.016 long: 1 -8.89,0; 2 -6.35,0; 3 -3.81,0; 4 -1.27,0; 5 1.27,0; 6 3.81,0; 7 6.35,0; 8 8.89,0
MA04-1 = drill 1.016 long: 1 -3.81,0; 2 -1.27,0; 3 1.27,0; 4 3.81,0
MA07-1 = drill 1.016 long: 1 -7.62,0; 2 -5.08,0; 3 -2.54,0; 4 0,0; 5 2.54,0; 6 5.08,0; 7 7.62,0
MA06-1 = drill 1.016 long: 1 -6.35,0; 2 -3.81,0; 3 -1.27,0; 4 1.27,0; 5 3.81,0; 6 6.35,0
SMS-008 = smd 1.092 x 2.007: 1 -8.89,-4.496; 2 -6.35,-4.496; 3 -3.81,-4.496; 4 -1.27,-4.496; 5 1.27,-4.496; 6 3.81,-4.496; 7 6.35,-4.496; 8 8.89,-4.496; 9 8.89,4.496; 10 6.35,4.496; 11 3.81,4.496; 12 1.27,4.496; 13 -1.27,4.496; 14 -3.81,4.496; 15 -6.35,4.496; 16 -8.89,4.496
P8X32A-Q44 = smd 1.9 x 0.4: 1 -5.713,4.013; 2 -5.713,3.212; 3 -5.713,2.413; 4 -5.713,1.613; 5 -5.713,0.812; 6 -5.713,0.013; 7 -5.713,-0.787; 8 -5.713,-1.587; 9 -5.713,-2.388; 10 -5.713,-3.188; 11 -5.713,-3.987; 23 5.688,-3.987; 24 5.688,-3.188; 25 5.688,-2.388; 26 5.688,-1.587; 27 5.688,-0.787; 28 5.688,0.013; 29 5.688,0.812; 30 5.688,1.613; 31 5.688,2.413; 32 5.688,3.212; 33 5.688,4.013 | smd 0.4 x 1.9: 12 -4.013,-5.688; 13 -3.212,-5.688; 14 -2.413,-5.688; 15 -1.613,-5.688; 16 -0.812,-5.688; 17 -0.013,-5.688; 18 0.787,-5.688; 19 1.587,-5.688; 20 2.388,-5.688; 21 3.188,-5.688; 22 3.987,-5.688; 34 3.987,5.713; 35 3.188,5.713; 36 2.388,5.713; 37 1.587,5.713; 38 0.787,5.713; 39 -0.013,5.713; 40 -0.812,5.713; 41 -1.613,5.713; 42 -2.413,5.713; 43 -3.212,5.713; 44 -4.013,5.713
TSSOP20 = smd 1 x 0.4: 1 -2.937,2.693; 2 -2.937,2.032; 3 -2.937,1.372; 4 -2.937,0.712; 5 -2.937,0.051; 6 -2.937,-0.609; 7 -2.937,-1.27; 8 -2.943,-1.93; 9 -2.937,-2.59; 10 -2.937,-3.251; 11 2.905,-3.251; 12 2.905,-2.59; 13 2.911,-1.93; 14 2.905,-1.27; 15 2.905,-0.609; 16 2.905,0.051; 17 2.905,0.712; 18 2.905,1.372; 19 2.905,2.032; 20 2.905,2.693
SO08 = smd 0.61 x 2.21: 1 -1.905,-2.616; 2 -0.635,-2.616; 3 0.635,-2.616; 4 1.905,-2.616; 5 1.905,2.616; 6 0.635,2.616; 7 -0.635,2.616; 8 -1.905,2.616
DEANS = drill 4.8 square: P$1 -3.48,-0.025; P$2 3.378,-0.025
PDIP16 = smd 0.6 x 1.5: P$1 0,0; P$2 1.27,0; P$3 2.54,0; P$4 3.81,0; P$5 5.08,0; P$6 6.35,0; P$7 7.62,0; P$8 8.89,0; P$9 8.89,5.4; P$10 7.62,5.4; P$11 6.35,5.4; P$12 5.08,5.4; P$13 3.81,5.4; P$14 2.54,5.4; P$15 1.27,5.4; P$16 0,5.4

### Placement (x,y rotation side)
3V3INDUC  70.36,19.05 180 top
5VINDUC  58.42,18.8 180 top
C1  61.47,38.35 270 top
C2  70.1,38.35 270 top
C3  61.47,57.66 270 top
C4  70.1,57.66 270 top
C5  61.47,43.18 270 top
C6  70.1,43.18 270 top
C7  61.47,62.48 270 top
C8  70.1,62.48 270 top
C9  61.47,48.01 270 top
C10  70.1,48.01 270 top
C11  61.47,67.31 270 top
C12  70.1,67.31 270 top
C13  61.47,52.83 270 top
C14  70.1,52.83 270 top
C15  61.42,72.06 270 top
C16  70.05,72.06 270 top
C17  40.12,45.9 225 top
C18  48.11,41.73 270 top
C19  12.83,58.17 90 top
C20  48.11,61.75 270 top
C21  61.72,6.86 270 top
C22  47.4,20.45 270 top
C23  50.42,20.47 270 top
C24  26.95,45.44 135 top
C25  26.59,58.29 45 top
C27  19,60.83 90 top
D1  79.5,24.13 0 top
D2  79.38,13.23 0 top
D3  79.5,6.6 0 top
IC1  24.62,61.43 315 top
IC2  75.18,38.35 0 top
IC3  75.18,57.66 0 top
IC4  75.18,43.18 0 top
IC5  75.18,62.48 0 top
IC6  75.18,48.01 0 top
IC7  75.18,67.31 0 top
IC8  75.18,52.83 0 top
IC9  75.13,72.06 0 top
JP1  15.53,69.27 180 top
JP2  10.41,62.99 90 top
JP3  7.87,62.99 90 top
JP4  5.33,62.99 90 top
JP5  2.79,62.99 90 top
JP6  2.79,48.01 270 top
JP7  5.33,48.01 270 top
JP8  7.87,48.01 270 top
JP9  10.41,48.01 270 top
JP10  50.55,12.19 270 top
JP11  48.01,12.19 270 top
JP12  45.47,12.19 270 top
JP13  42.93,12.19 270 top
JP14  37.85,12.19 270 top
JP15  35.31,12.19 270 top
JP16  30.23,12.19 270 top
JP17  27.69,12.19 270 top
JP18  22.61,12.19 270 top
JP19  20.07,12.19 270 top
JP20  17.53,12.19 270 top
JP21  14.99,12.19 270 top
JP22  9.91,12.19 270 top
JP23  7.37,12.19 270 top
JP24  4.83,12.19 270 top
JP25  2.29,12.19 270 top
JP26  8.64,3.3 0 top
JP27  31.5,3.3 0 top
LED1  19.56,20.57 90 top
LED2  24.38,20.57 90 top
LED3  29.21,20.57 90 top
LED4  1.12,21.62 90 top
LED5  2.77,21.62 90 top
Q2  40.22,58.73 315 top
R1  31.81,64.74 315 top
R2  67.82,38.35 270 top
R3  65.79,38.35 90 top
R4  63.75,38.35 270 top
R5  72.39,38.35 270 top
R6  61.47,7.11 0 bottom
R7  67.82,57.66 270 top
R8  65.79,57.66 90 top
R9  63.75,57.66 270 top
R10  72.39,57.66 270 top
R11  77.98,36.07 0 bottom
R12  67.82,43.18 270 top
R13  65.79,43.18 90 top
R14  63.75,43.18 270 top
R15  72.39,43.18 270 top
R16  95.44,10.22 180 top
R17  67.82,62.48 270 top
R18  65.79,62.48 90 top
R19  63.75,62.48 270 top
R20  72.39,62.48 270 top
R21  77.98,44.7 0 bottom
R22  67.82,48.01 270 top
R23  65.79,48.01 90 top
R24  63.75,48.01 270 top
R25  72.39,48.01 270 top
R26  64.52,18.03 0 bottom
R27  67.82,67.31 270 top
R28  65.79,67.31 90 top
R29  63.75,67.31 270 top
R30  72.39,67.31 270 top
R31  77.98,53.34 0 bottom
R32  67.82,52.83 270 top
R33  65.79,52.83 90 top
R34  63.75,52.83 270 top
R35  72.39,52.83 270 top
R36  52.32,18.54 0 bottom
R37  67.77,72.06 270 top
R38  65.74,72.06 90 top
R39  63.7,72.06 270 top
R40  72.34,72.06 270 top
R41  77.98,62.23 0 bottom
R42  28.45,17.78 0 top
R43  23.62,17.78 0 top
R44  82.61,20.07 180 top
R45  82.61,18.54 180 top
R46  18.8,17.78 0 top
R47  19.56,70.1 0 top
R48  16.76,70.1 180 top
R49  28.98,67.58 315 top
R50  1.12,18.26 90 top
R51  2.77,18.26 90 top
SPOWINDUC  69.6,6.6 180 top
SV1  35.31,37.59 0 top
SV2  12.95,37.59 0 top
SV25  39.52,69.44 0 top
SV26  16,54.58 270 top
SV27  33.02,72.92 180 top
SW1  35.31,29.97 0 top
SW2  12.95,29.97 0 top
U$1  33.4,51.69 45 top
U$2  35.81,19.56 270 top
U$3  13.21,19.56 270 top
U$4  88.2,14.67 180 top
U$5  87.95,24.13 180 top
U$6  88.33,4.38 180 top
U$7  87.07,71.37 0 top
U$8  88.65,63.75 0 top
U$9  88.65,54.61 0 top
U$10  88.65,45.72 0 top
U$11  88.65,37.08 0 top
U$12  96.01,22.35 90 top
X1  55.88,60.45 90 top
X2  56.01,40.51 90 top
X3  4.83,59.94 270 top

### Tracks (layer width: path | path; a pad name or v marks a point on that pad's centre or on a via)
3V3CUR  (via drill 0.3)
  Top 0.203: IC6.3 76.13,47.41 IC6.5 74,49.31 73.46,49.86 68.77,49.86 R22.1 67.82,49.45 v67.41,49.86
  Top 1.27: R45.2 71.35,18.54 68.36,21.53 3V3INDUC.P$1 68.36,19.01 68.25,18.9 64.97,15.62 64.97,14.1 53.29,14.1 52.6,14.78 52.6,21.03 51.82,21.82 51.76,21.87 C23.1
  Bottom 0.203: v67.41,49.86 66.48,48.92 R26.P$1 67.84,21.55 3V3INDUC.P$1
5V  (via drill 0.3 pad 0.61)
  Top 0.152: v64.28,55.28 64.57,55.07 75.12,55.07 IC8.4
  Top 0.305: 11.18,4.55 15.01,4.55 JP26.4 18.17,5.27 18.82,5.27 | JP26.1 9.88,4.55 11.18,4.55 | 11.18,4.55 11.18,8.38 JP22.2 JP23.2 JP24.2 JP25.2 | 22.06,10.92 21.34,11.65 21.34,12.74 18.89,15.19 15.89,15.19 15.24,15.84 U$3.19 | 29.21,20.72 28.76,20.72 25.23,17.19 25.23,13.05 23.1,10.92 22.06,10.92 | 18.82,5.27 18.8,7.66 19.55,8.41 20.64,8.41 21.34,9.11 21.34,10.2 22.06,10.92 | 18.82,5.27 29.53,5.27 JP27.1 32.74,4.55 37.87,4.55 JP27.4 | U$2.19 37.85,17.46 34.59,20.72 29.21,20.72 | LED3.A 29.21,20.72 | v51.83,40.51 51.66,40.51 X2.P$16 50.08,40.51 | X2.P$15 49.55,41.78 49.55,41.04 50.08,40.51 | 50.08,40.51 49.55,40.51 49.49,40.51 49.31,40.33 C18.2 | 36.32,71.11 36.3,71.09 35.89,71.09 35.71,71.27 SV25.1 | 36.32,71.11 | 36.32,71.11 36.39,71.04 37.31,71.04 37.58,71.31 38.69,71.31 38.94,71.06 39.81,71.06 40.03,71.28 43.81,71.28 45.54,69.55 45.54,63.47 47.55,61.45 48.11,61.45 48.11,60.9 | 12.83,65.53 JP2.2 JP3.2 JP4.2 JP5.2 | 12.83,65.53 16.86,69.57 16.86,70.78 18.27,72.19 18.27,74.3 18.89,74.91 26.51,74.91 26.67,74.75 SV27.6 | 12.83,65.53 12.83,60.67 C19.2 11.62,59.57 11.28,59.57 | 11.28,59.57 11.28,58.67 X3.P$15 9.17,58.67 5.97,55.47 3.94,55.47 1.5,53.02 1.5,46.76 JP6.2 JP7.2 JP8.2 JP9.2 | 11.28,59.57 11.28,59.94 X3.P$16 | 49.42,60.9 49.42,61.72 X1.P$15 | 49.42,60.9 49.87,60.45 49.95,60.45 X1.P$16 | C20.2 48.11,60.9 | 48.11,60.9 49.42,60.9
  Bottom 0.305: v64.28,55.28 63.27,55.28 62.53,55.28 58.67,51.31 58.67,47.24 v51.83,40.51 51.83,24.09 50.38,22.65 R36.P$5 | JP6.2 0.99,43.66 0.99,10.95 JP25.2 | SV25.1 35.71,71.27 35.27,71.27 35.09,71.09 26.67,71.09 SV27.6
  Bottom 1.27: R36.P$5 50.27,20.57 43.41,20.57 40.26,17.42 40.26,6.91 40.26,6.2 39.22,5.16 39.12,5.05 JP27.4
5VCUR  (via drill 0.3 pad 0.61)  (1 unrouted)
  Top 0.152: v62.99,54.63 67.07,54.64 67.84,54.64 67.84,54.63 | IC8.5 73.73,54.64 73.73,54.63 67.84,54.63 | 67.84,54.63 67.82,54.63 67.84,54.61 67.84,53.72 67.84,54.63
  Top 0.305: IC8.5 74.23,53.23 75.33,53.23 76.13,52.43 IC8.3
  Top 0.61: U$5.3 87.33,26.76 87.33,28.09 87.61,28.37 87.61,29.74 86.69,30.66 85.47,30.66 84.2,29.39 84.2,28.78
  Top 1.27: 84.2,28.78 83.69,28.27 62.99,28.27 56.42,21.7 5VINDUC.P$1 56.41,21.29 56.11,21.59 56.11,23.75 55.22,24.64 48.72,24.64 47.4,23.32 C22.1
  Bottom 0.305: v62.99,54.63 59.69,51.31 59.69,46.48 56.03,42.84 56.03,22.65 56.42,22.25 5VINDUC.P$1
  Bottom 1.27: 5VINDUC.P$1 55.82,20.69 R36.P$1
A0
  Top 0.203: X3.P$1 3.82,59.94 3.82,61.96 JP5.1
A1
  Top 0.203: X3.P$2 5.83,58.67 5.83,62.5 JP4.1
A2
  Top 0.203: JP3.1 7.87,59.45 5.83,57.4 X3.P$3
A3
  Top 0.203: X3.P$4 5.83,56.13 9.07,59.37 9.07,61.65 JP2.1
A4
  Top 0.203: X3.P$5 5.83,54.86 9.07,51.63 9.07,49.35 JP9.1
A5
  Top 0.203: X3.P$6 5.83,53.59 7.87,51.55 JP8.1
A6
  Top 0.203: X3.P$7 5.83,52.32 5.83,48.5 JP7.1
A7
  Top 0.203: X3.P$8 3.82,51.05 3.82,49.03 JP6.1
BREAKOUT_0
  Top 0.305: U$3.15 12.6,14.88 JP22.1
BREAKOUT_1
  Top 0.305: U$3.14 11.94,15.85 11.64,15.85 7.98,12.19 JP23.1
BREAKOUT_2
  Top 0.305: U$3.13 11.28,16.13 8.62,13.48 6.11,13.48 JP24.1
BREAKOUT_3
  Top 0.305: U$3.12 10.62,16.12 9.29,14.79 4.89,14.79 JP25.1
C_SENSE_OUT_0
  Top 0.203: IC3.1 72.68,57.9 72.39,57.9 R10.1 71.16,58.56 71.11,58.51 C4.1 69.1,58.51 69.1,58.43 68.56,57.89 67.09,57.89 66.64,58.34 66.64,59.06 66.01,59.7 58.91,59.7 56.88,61.72 X1.P$2
C_SENSE_OUT_1
  Top 0.203: X1.P$4 66.28,64.26 66.66,63.88 66.66,63.15 67.1,62.71 68.56,62.71 69.1,63.26 69.1,63.33 C8.1 71.11,63.33 71.16,63.38 R20.1 72.39,62.73 73.54,62.73 74.23,62.03 IC5.1
C_SENSE_OUT_2
  Top 0.203: X1.P$6 56.88,66.8 59.15,69.06 66.31,69.06 66.64,68.73 66.64,68 67.08,67.56 68.57,67.56 69.1,68.08 69.1,68.16 C12.1 71.11,68.16 71.16,68.21 R30.1 73.24,68.21 74.23,67.22 74.23,66.86 IC7.1
C_SENSE_OUT_3  (via drill 0.3)
  Top 0.152: IC9.1 74.18,71.92 73.66,72.44 73.14,72.96 R40.1 72.29,72.91 C16.1 69.41,72.26 69.38,72.29 67,72.29 66.78,72.52 66.78,73.48 65.96,74.3 59.97,74.3 59.56,73.89 v59.56,73.81 | v59.56,71.98 56.92,69.34 X1.P$8
  Bottom 0.152: v59.56,73.81 v59.56,71.98
C_SENSE_OUT_4
  Top 0.203: IC2.1 74.23,37.9 73.54,38.6 72.39,38.6 R5.1 71.16,39.25 71.11,39.2 C2.1 69.1,39.2 69.1,39.13 68.57,38.6 67.08,38.6 66.64,39.03 66.64,39.76 65.13,41.27 57.52,41.27 57.01,41.78 X2.P$2
C_SENSE_OUT_5
  Top 0.203: IC4.1 74.23,42.73 73.54,43.43 72.39,43.43 R15.1 71.16,44.08 71.11,44.03 C6.1 69.1,44.03 69.1,43.95 68.56,43.41 67.1,43.41 66.66,43.85 66.66,44.58 66.31,44.93 58.28,44.93 57.67,44.32 X2.P$4
C_SENSE_OUT_6
  Top 0.203: X2.P$6 57.01,46.86 59.91,49.76 66.31,49.76 66.66,49.41 66.66,48.68 67.1,48.23 68.56,48.23 69.1,48.78 69.1,48.86 C10.1 71.49,48.86 71.54,48.91 71.96,48.91 72.34,48.91 | IC6.1 74.23,47.55 73.7,47.55 72.34,48.91 | R25.1 72.34,48.91
C_SENSE_OUT_7
  Top 0.152: IC8.1 R35.1
  Top 0.203: R35.1 71.16,53.73 71.11,53.68 C14.1 69.36,52.93 68.22,52.93 65.18,52.93 64.72,52.48 64.72,51.26 64.41,50.95 62.87,50.95 62.38,50.47 58.88,50.47 57.81,49.4 X2.P$8
CLK  (via drill 0.3 pad 0.61)  (1 unrouted)
  Top 0.203: v49.46,44.89 49.6,44.76 49.6,44.32 X2.P$13 | v49.26,64.47 49.48,64.26 X1.P$13 | v11.45,56.13 11.23,56.13 X3.P$13 | U$1.32 34.15,56.98 v34.05,56.98
  Bottom 0.203: v49.26,64.47 49.26,63.05 | v11.45,56.13 11.52,56.06 31.02,56.06 31.81,56.85 34.05,56.85 v34.05,56.98
  Bottom 0.305: 34.05,56.85 41.37,49.52 | 41.37,49.52 46.01,44.88 v49.45,44.88 v49.46,44.89 | 49.26,63.05 49.26,57.41 41.37,49.52
CS1
  Top 0.203: X1.P$10 51.48,68.07 51.48,67.34 51.87,66.96 51.87,59.85 50.47,58.45 49.97,58.45 46.95,55.44 44.7,53.34 42.16,53.34 40.13,55.37 39.88,55.37 39.62,55.37 39.33,55.37 U$1.26
CS2  (1 unrouted)
  Top 0.203: U$1.25 39.96,54.87 46.7,48.13 X2.P$10
CS3  (via drill 0.3 pad 0.61)  (1 unrouted)
  Top 0.203: v12.06,52.41 11.31,52.41 11.23,52.32 X3.P$10 | v31.62,52.43 38.65,52.43 38.83,52.6 U$1.24
  Bottom 0.203: v31.62,52.43 30.21,51.02 13.45,51.02 v12.06,52.41
DIN  (via drill 0.3 pad 0.61)  (1 unrouted)
  Top 0.203: 50.73,65.53 51.48,66.28 51.48,66.8 X1.P$11 49.48,66.8 49.48,68.51 49.65,68.68 51.41,68.68 52.25,67.83 52.25,52.47 49.6,49.83 49.6,48.94 49.69,48.85 51.34,48.85 51.61,48.58 51.61,47.37 51.11,46.86 | 50.73,65.53 50.98,65.53 51.51,65 51.51,60.08 50.73,59.29 43.61,59.29 43.46,59.44 43.43,59.44 42.93,59.94 38.86,64.01 37.34,64.01 35.05,61.72 35.05,61.21 35.05,59.94 36.32,58.67 36.32,58.02 U$1.31 35.29,56.99 34.87,56.56 34.71,56.56 34.31,56.16 v31.91,56.16 | X1.P$12 50.73,65.53 | 51.11,46.86 51.61,46.36 51.61,45.59 X2.P$12 | 11.23,54.23 v12.23,54.23 | 11.23,54.23 11.23,53.59 X3.P$11 | 11.23,54.23 11.23,54.86 X3.P$12 | X2.P$11 51.11,46.86
  Bottom 0.203: v31.91,56.16 31.35,55.6 13.61,55.6 v12.23,54.23
EC0
  Top 0.203: SW2.9 21.84,35.73 SV2.8 24.09,37.59 26.3,39.8 28.08,39.8 29.18,40.91 32.37,40.91 34.45,42.99 35.92,44.45 35.9,44.63 35.15,45.38 U$1.13
EC1  (1 unrouted)
  Top 0.203: SW2.10 SV2.7 19.3,39.37 24.89,39.37 26.77,41.24 28.72,41.24 30.77,43.3 31.35,43.3 33.73,45.68 U$1.12
EC2  (1 unrouted)
  Top 0.203: 31.33,43.98 30.94,43.98 29.2,42.24 26.52,42.24 26.16,41.88 24.07,39.8 18.97,39.8 18.54,39.37 16.76,39.37 SV2.6 SW2.11 | 31.33,43.98 | U$1.11 31.33,43.98
EC3  (1 unrouted)
  Top 0.203: 25.75,42.22 24.49,40.95 23.76,40.22 22.25,40.22 16.85,40.22 16,39.37 14.22,39.37 SV2.5 SW2.12 | 25.75,42.22 25.77,42.24 | 30.76,44.54 30.63,44.54 28.68,42.59 26.14,42.59 25.76,42.22 25.75,42.22 | 30.76,44.54 | U$1.10 30.76,44.54
ECS0
  Top 0.305: U$3.20 15.9,15.85 18.95,15.85 JP18.1
ECS1
  Top 0.305: JP19.1 18.48,13.78 16.65,13.78 14.58,15.85 U$3.18
ECS2
  Top 0.305: U$3.17 13.92,15.8 JP20.1
ECS3
  Top 0.305: U$3.16 13.26,13.92 JP21.1
GND  (via drill 0.3, 1.1)  (8 unrouted)
  Top 0.152: IC8.2 75.16,51.5 75.16,50.88 75.06,50.77 74.95,50.7 73.23,50.7 72.42,51.59 72.42,51.92 72.4,51.92 R35.2 | 63.7,71.12 61.51,71.12 C15.2 60.49,71.21 56.72,67.44 56.59,67.44 53.95,67.44 53.82,67.56 53.82,69.32 53.8,69.34 59.36,74.91 67.71,74.91 | 63.7,71.12 63.73,71.12 63.7,71.12 | 63.7,71.12 R39.2 63.75,71.21 63.75,71.68 63.91,71.83 68.48,71.83 69.1,71.21 C16.2 72.29,71.21 R40.2 72.38,71.16 73.64,69.9 73.86,69.9 74.7,69.9 74.78,69.98 74.78,70.4 IC9.2 | IC3.2 74.98,56.15 74.98,55.68 74.8,55.5 73.36,55.5 72.39,56.46 R10.2
  Top 0.203: 66.87,56.05 66.83,56.01 63.75,56.01 63.07,55.32 59.41,55.32 58.65,54.56 v58.65,54.46 | v58.65,52.76 59.36,52.05 61.47,52.05 C13.2 | R10.2 72.35,56.79 70.1,56.79 70.08,56.82 69.09,56.82 arc-90 68.33,56.06 66.73,56.06 v66.73,55.93 | v66.75,51.16 70.1,51.16 C14.2
  Top 0.305: 54.83,62.38 54.83,59.99 58.01,56.81 | 54.92,64.93 54.83,64.83 54.83,62.38 | 54.83,62.38 59.67,62.38 60.41,61.63 C7.2 62.52,61.63 62.57,61.58 R19.2 63.75,62.29 68.56,62.29 69.05,61.8 69.05,61.63 C8.2 71.16,61.63 71.21,61.58 R20.2 72.39,60.88 73,60.27 75.18,60.27 IC5.2 | 51.66,49.4 58.01,55.75 58.01,56.81 | 58.01,56.81 C3.2 62.52,56.81 62.57,56.76 R9.2 63.75,56.05 66.87,56.05 | 51.66,49.4 52.2,48.87 52.2,47.71 54.95,44.96 | X2.P$9 51.66,49.4 | 1.12,17.01 0.99,16.88 0.99,8.41 JP25.3 JP24.3 JP23.3 JP22.3 | 1.12,17.01 1.51,17.01 1.86,17.36 R51.1 3.67,17.36 3.68,17.35 9.96,17.35 | IC4.2 75.18,40.97 73,40.97 72.39,41.58 R15.2 71.21,42.28 71.16,42.33 C6.2 69.05,42.33 69.05,42.49 68.56,42.98 63.75,42.98 R14.2 62.57,42.28 62.52,42.33 C5.2 60.41,42.33 60.33,42.42 54.91,42.42 | R10.2 71.21,56.76 71.16,56.81 70.63,56.81 C4.2 69.05,56.81 69.05,56.52 68.58,56.05 66.87,56.05 | 54.92,64.93 60.89,64.93 61.47,65.5 C11.2 62.52,66.46 62.83,66.76 63.75,66.76 | 53.8,69.34 53.8,66.05 54.92,64.93 | 53.8,69.34 59.36,74.91 67.71,74.91 | 53.8,69.34 51.53,69.34 X1.P$9 49.42,69.34 48.38,69.34 | 54.95,44.96 54.15,44.15 54.15,43.18 | 54.95,44.96 56.89,44.96 59.09,47.16 C9.2 62.52,47.16 62.57,47.11 R24.2 63.75,47.81 68.56,47.81 69.05,47.32 69.05,47.16 C10.2 71.16,47.16 71.21,47.11 R25.2 72.39,46.4 73,45.8 75.18,45.8 IC6.2 | C17.2 38.28,45.76 38.28,46.75 38.3,46.77 U$1.17 35.96,49.11 29.67,49.11 | 31.01,54.07 31.21,54.27 37.09,54.27 U$1.27 | 28.55,51.61 31.01,54.07 | 31.01,54.07 30.24,54.83 U$1.39 28.46,56.61 | 11.67,48.41 23.73,48.41 26.93,51.61 28.55,51.61 | 28.55,51.61 28.55,51.36 29.41,50.5 29.41,49.38 29.67,49.11
  Top 0.305: 29.67,49.11 U$1.5 28.79,47.84 | 27.19,58.89 27.19,57.87 28.45,56.61 28.46,56.61 | 28.46,56.61 | C25.2 27.19,58.89 | R50.1 1.12,17.01 | 67.71,74.91 | 67.71,74.91 86.9,74.91 U$7.P$2 | 54.91,42.42 54.91,40.08 57.48,37.5 C1.2 62.8,37.5 62.85,37.45 R4.2 63.75,38.16 68.56,38.16 69.05,37.67 69.05,37.5 69.58,37.5 C2.2 71.44,37.5 71.48,37.45 R5.2 72.39,37.1 73.35,36.14 75.18,36.14 IC2.2 | 26.41,8.39 26.41,15.52 27.55,16.65 | 29.21,74.75 39.37,74.75 SV27.1 44.8,72.92 48.38,69.34 | 29.21,74.75 28.57,75.4 12.21,75.4 11.72,74.91 JP1.4 11.72,71.25 10.41,69.94 JP2.3 JP3.3 JP4.3 JP5.3 | SV27.5 29.21,74.75 | 28.79,47.84 29.17,47.84 U$1.6 | C24.2 26.99,46.42 28.4,47.84 28.79,47.84 | R43.1 22.02,17.78 21.11,16.88 19.15,16.88 18.6,17.43 18.6,17.78 R46.1 10.38,17.78 9.96,17.35 | 26.41,8.39 JP17.3 | 26.41,8.39 23.88,8.39 JP18.3 JP19.3 | 27.55,16.65 R42.1 | U$2.11 27.55,16.65 | IC1.4 22.6,58.03 22.14,58.49 | 21.46,59.43 21.46,59.16 21.68,58.95 22,59.27 | 21.46,59.43 21.46,59.65 21.54,59.73 IC1.1 | 21.46,59.43 20.2,59.43 C27.1 17.79,59.43 17.56,59.66 SV26.2 14.17,59.66 14.17,58.66 13.38,57.87 12.83,57.87 C19.1 | IC1.3 22.14,58.49 | 22,59.27 22,59.03 21.93,58.95 21.93,58.7 22.14,58.49 | IC1.2 22,59.27 | IC1.7 25.82,63.09 26.03,62.87 26.03,60.05 27.19,58.89 | 11.67,48.41 11.67,51.05 | 11.67,48.41 11.67,44.18 JP9.3 JP8.3 JP7.3 JP6.3 | 63.75,66.76 63.75,67.11 68.56,67.11 69.05,66.63 69.05,66.46 C12.2 71.16,66.46 71.21,66.41 R30.2 72.39,66.06 73.35,65.1 75.18,65.1 IC7.2 | R29.2 63.75,66.76 | 11.67,51.05 12.88,52.26 12.88,55.61 12.83,55.66 C19.1 | 11.67,51.05 11.28,51.05 X3.P$9 | 54.15,43.18 51.79,43.18 51.66,43.05 X2.P$14 49.39,43.05 49.31,43.13 C18.1
  Top 0.305: 54.15,43.18 54.91,42.42 | 41.66,7.11 JP27.5 | C19.1 12.7,56.77 11.62,56.77 11.28,57.11 11.28,57.4 X3.P$14 | U$5.8 89.85,21.69 89.85,21.87 | 87.31,21.87 87.31,21.69 U$5.6 | 66.87,56.05 | 48.38,69.34 48.38,63.15 | 48.38,63.15 49.31,63.15 49.42,63.03 49.42,62.99 X1.P$14 | C20.1 48.38,63.15 | 9.96,17.35 9.96,17.34 U$3.11 | R35.2 71.21,51.93 71.16,51.98 C14.2 | U$5.7 88.58,21.87 | JP21.3 JP20.3 | C13.2 62.52,51.98 62.57,51.93 R34.2
  Top 0.61: U$6.8 90.22,1.75 | 88.98,1.75 U$6.7 | U$6.5 U$6.4 86.03,6.6 | C23.2 50.42,14.81 52.81,12.42 52.81,8.84 52.81,7.11 52.32,7.11
  Top 1.27: JP17.3 JP16.3 JP15.3 JP14.3 41.66,7.11 JP13.3 JP12.3 JP11.3 JP10.3 52.32,7.11 53.14,7.11 54.79,5.46 C21.2 63.15,5.46 63.27,5.33 63.35,5.33 67.54,1.14 85.8,1.14 86.39,1.73 86.39,6.96 U$6.4 | 90.22,1.75 88.98,1.75 | U$6.7 U$6.6 U$6.5 | 86.03,6.6 D3.A | 82.72,12.05 82.7,12.06 | 82.7,12.06 81.53,13.23 D2.A | U$4.8 90.09,12.06 88.85,12.06 U$4.7 U$4.6 U$4.5 82.72,12.05 | U$5.8 U$5.7 U$5.6 U$5.5 | R44.2 81.71,21.72 | 81.71,21.72 81.71,24.12 D1.A | v86.03,29.29 86.04,29.27 U$5.4 | U$5.5 85.84,21.72 81.71,21.72 | U$5.5 85.62,21.51 v84.05,23.09 | U$4.4 85.25,17.29 v85.06,17.48 | U$6.4 86.42,1.79 86.44,1.78 v92.63,1.78 | U$6.4 86.41,6.99 86.41,3.86 86.08,4.19 v84.2,4.19 | v84.23,11.99 84.15,12.06 82.7,12.06 | 82.7,12.06 82.72,12.05 | C22.2 50.39,19.05 C23.2
  Bottom 0.203: v58.65,54.46 v58.65,52.76 | v66.73,55.93 66.75,55.93 v66.75,51.16
  Bottom 0.305: 18.8,5.84 JP26.5 | JP19.3 18.8,5.84 | JP20.3 18.8,5.84 | 11.18,5.84 JP22.3 | JP26.2 11.18,5.84 | JP21.3 12.45,7.11 11.18,5.84 | SV26.2 14.17,59.66 14.17,64.31 JP2.3 | JP27.2 35.31,4.57 JP15.3 | SV27.1 39.37,71.09 38.93,71.09 38.75,71.27 38.25,71.27 SV25.2
  Bottom 1.27: v85.06,17.48 85.06,22.07 v84.05,23.09 84.05,27.3 v86.03,29.29 92.48,29.29 U$12.P$2 99.31,25.73 100.08,24.97 100.08,9.22 v92.63,1.78 | v84.2,4.19 84.23,4.22 v84.23,11.99
  Bottom 6.096: U$7.P$2 92.02,69.77 U$8.P$2 U$9.P$2 U$10.P$2 U$11.P$2 96.04,33.05 U$12.P$2
  pour Bottom (isolate 0.61, no thermals): 0,76.2 101.6,76.2 101.6,0 0,0
  pour Top (isolate 0.61, no thermals): 0,76.2 101.6,76.2 101.6,0 0,0
IMU_RX  (1 unrouted)
  Top 0.203: SV25.3 40.79,67.67 39.6,67.67 31.33,59.4 U$1.34
IMU_TX
  Top 0.203: SV25.4 43.33,68.73 41.15,66.55 40.64,66.55 39.12,66.55 34.54,61.98 34.54,58.67 34.54,58.59 U$1.33
LOGICBAT
  Top 0.203: R12.1 67.82,44.73 68.02,44.93 73.36,44.93 74.23,44.06 | 74.23,44.06 74.23,43.63 75.23,43.63 76.13,42.73 IC4.3 | IC4.5 74.23,44.06 | U$12.P$1 99.14,18.87 99.82,19.56 99.82,28.96 99.31,29.46 90.42,29.46 87.88,32 81.03,32 79.5,33.53 79.5,42.67 76.71,45.47 75.64,45.47 75.29,45.11 74.65,44.48 74.24,44.48 IC4.5 | IC4.5
  Top 1.27: R16.P$1 95.43,10.05 95.43,18.09 96.01,18.67 96.01,18.77 96.04,18.8 U$12.P$1
LOGICPOW
  Top 0.203: IC4.4 76.13,43.63 78.44,41.33 78.44,37.56 78.44,33.57 80.52,31.5 87.38,31.5 87.38,31.4 89.85,28.92 89.85,28.11 U$5.1
  Top 0.61: 91.64,24.61 89.85,26.4 U$5.1 | U$4.1 90.47,17.65 91.64,17.65
  Top 1.27: R16.P$5 91.64,9.93 91.64,17.65 91.64,24.61
M1
  Top 0.152: IC9.3 76.08,71.47 IC9.5 74.22,73.4 74.22,74.14 74.12,74.24 68.2,74.24 67.77,73.81 R37.1
  Top 0.203: IC9.3 76.08,69.9 76.22,69.9 82,64.12 82,63.73 U$8.P$1
  Bottom 3.302: R41.P$1 80.59,63.73 83.57,63.73
  Bottom 6.096: 83.57,63.73 U$8.P$1
M2
  Top 0.203: R27.1 67.82,68.86 68.42,69.47 74.23,69.47 IC7.5 74.23,67.76 75.14,66.86 76.13,66.86 IC7.3 76.13,65.58 76.13,65.15 75.58,64.6 75.58,63.05 82,56.63 82,54.59 U$9.P$1
  Bottom 3.302: R31.P$1 80.84,54.59 83.31,54.59
  Bottom 6.096: 83.31,54.59 U$9.P$1
M3
  Top 0.203: U$10.P$1 85.17,48.86 84.71,48.86 77.49,56.07 77.49,58.96 76.13,60.32 IC5.3 76.13,61.59 74.79,62.94 74.23,62.94 IC5.5 74.23,64.64 68.42,64.64 67.82,64.04 R17.1
  Bottom 3.302: R21.P$1 80.31,46.48 83.31,46.48
  Bottom 6.096: 83.31,46.48 84.1,45.7 U$10.P$1
M4
  Top 0.203: 74.23,58.54 74.51,58.54 75.84,57.21 76.13,57.21 IC3.3 76.13,55.82 76.13,55.5 82,49.63 82,42.59 84.38,40.22 85.17,40.22 U$11.P$1 | R7.1 67.82,59.21 68.02,59.41 73.36,59.41 74.23,58.54 | IC3.5 74.23,58.54
  Bottom 3.302: R11.P$1 80.31,37.85 83.57,37.85
  Bottom 6.096: 83.57,37.85 84.35,37.06 U$11.P$1
MOTORBAT  (via drill 0.3)
  Top 0.203: U$7.P$1 81.31,71.35 80.59,71.35 80.43,71.35 79.27,72.51 76.08,72.51 IC9.4 | IC3.4 76.07,58.9 76.07,58.09 v76.25,57.76
  Top 0.305: IC7.4 75.28,69.47 v75.16,69.47 | IC5.4 76.91,64.57 v77.42,64.57
  Top 0.61: U$6.1 90.23,8.83 v90.04,9.02
  Bottom 0.203: 77.88,38.05 77.31,38.62 76.04,38.62 R11.P$5 | v76.25,57.76 75.92,57.68 75.92,55.63 76.04,55.51 R31.P$5
  Bottom 0.305: v75.16,69.47 75.21,69.47 75.18,69.49 75.16,69.49 v75.16,69.47 | v75.16,69.47 77.04,71.35 U$7.P$1 | v77.42,64.57 77.39,64.54 77.23,64.38 R41.P$5
  Bottom 0.61: v90.04,9.02 85.29,13.77 71.45,27.61 71.45,38.1
  Bottom 3.302: R41.P$5 75.9,64.52 71.37,64.52 | R31.P$5 75.9,55.63 71.37,55.63 | R21.P$5 75.9,46.99 71.37,46.99 | 76.04,38.62 75.51,38.1 71.45,38.1 71.37,38.1
  Bottom 6.096: 71.37,64.52 71.12,64.77 71.12,66.29 | 71.12,66.29 71.12,69.34 73.13,71.35 U$7.P$1 | 71.37,55.63 71.12,55.88 | 71.12,55.88 71.12,66.29 | 71.37,46.99 71.12,47.24 71.12,47.5 | 71.12,47.5 71.12,55.88 | 71.37,38.1 71.12,38.35 71.12,47.5
N0  (1 unrouted)
  Top 0.203: U$1.9 28.04,42.95 25.48,42.95 23.96,41.43 23.12,40.59 21.57,40.59 12.9,40.59 11.68,39.37 SV2.4 11.68,35.1 11.68,34.78 | 11.68,34.78 11.44,34.78 2.77,26.12 LED5.A | SW2.13 11.68,34.78
N1  (via drill 0.3 pad 0.61)  (1 unrouted)
  Top 0.203: 27.37,47.94 | 27.37,47.94 27,47.94 26.8,47.73 v26.62,47.73 | U$1.4 27.37,47.94 | SV2.3 SW2.14 9.14,33.21 1.12,25.18 LED4.A
  Bottom 0.203: SV2.3 9.14,39.37 18.26,39.37 v26.62,47.73
N2  (1 unrouted)
  Top 0.203: U$1.3 26.8,48.5 | 26.8,48.5 | 26.8,48.5 26.5,48.5 19.02,41.03 10.04,41.03 8.38,39.37 6.6,39.37 SV2.2 SW2.15
N3  (1 unrouted)
  Top 0.203: U$1.2 18.55,41.38 6.08,41.38 4.06,39.37 SV2.1 SW2.16
N$1  (via drill 0.3 pad 0.61)  (1 unrouted)
  Top 0.203: U$1.37 29.63,57.7 29.63,57.71 v29.49,57.85 | R47.2 20.46,70.96 19.68,70.96 19.34,71.3 JP1.1
  Bottom 0.203: JP1.1 19.34,68 v29.49,57.85
N$2  (via drill 0.3 pad 0.61)  (1 unrouted)
  Top 0.203: U$1.38 28.5,57.7 v28.47,57.7 | R48.2 15.86,70.96 16.46,70.96 16.8,71.3 JP1.2
  Bottom 0.203: v28.47,57.7 16.8,69.37 JP1.2
N$3
  Top 0.203: R50.2 LED4.C
N$4
  Top 0.203: R51.2 LED5.C
N$5
  Top 0.305: U$1.29 38.51,57.94 38.51,60.43 38.51,60.45 Q2.1
N$6
  Top 0.305: U$1.28 38.72,57.03 Q2.2
N$7  (via drill 0.3 pad 0.61)  (1 unrouted)
  Top 0.203: U$1.7 29.07,46.24 28.74,46.57 v28.36,46.57
  Bottom 0.203: v28.36,46.57 28.36,46.79 24.59,50.55 13.06,50.55 9.22,54.4 9.22,68.58 11.93,71.3 14.26,71.3 JP1.3
N$12
  Top 0.203: R3.1 R2.2
N$13
  Top 0.203: R8.1 R7.2
N$16
  Top 0.203: R13.1 R12.2
N$19
  Top 0.203: R18.1 R17.2
N$22
  Top 0.203: R23.1 R22.2
N$25
  Top 0.203: R28.1 R27.2
N$28
  Top 0.203: R33.1 R32.2
N$31
  Top 0.152: R37.2 67.76,71.17 65.84,71.17 65.83,71.16 R38.1
N$32
  Top 0.203: SW1.8 44.2,24.22 42.47,22.5 U$2.1
N$33
  Top 0.203: SW1.7 41.66,24.22 40.69,23.25 37.19,23.25 U$2.3
N$34
  Top 0.203: SW1.6 39.12,24.22 37.49,24.22 36.53,23.25 U$2.4
N$35
  Top 0.203: SW1.5 36.58,24.22 35.87,23.51 U$2.5
N$36
  Top 0.203: U$2.6 35.2,23.44 34.39,24.26 34.04,24.61 34.04,25.45 SW1.4
N$37
  Top 0.203: U$2.7 34.54,23.27 33.78,24.03 32.94,24.03 SW1.3
N$38
  Top 0.203: U$2.8 33.88,23.14 33.48,23.55 33.4,23.62 30.81,23.62 SW1.2
N$39
  Top 0.203: SW1.1 26.42,24.22 27.39,23.25 33.22,23.25 U$2.9
N$41
  Top 0.203: SW2.8 21.84,24.22 20.12,22.5 U$3.1
N$42
  Top 0.203: SW2.7 19.3,24.22 18.33,23.25 14.58,23.25 U$3.3
N$43
  Top 0.203: SW2.6 16.76,24.22 14.89,24.22 13.92,23.25 U$3.4
N$44
  Top 0.203: SW2.5 14.22,24.22 13.26,23.25 U$3.5
N$45
  Top 0.203: SW2.4 11.68,24.22 12.6,23.3 U$3.6
N$46
  Top 0.203: U$3.7 11.94,23.25 9.71,25.48 SW2.3
N$47
  Top 0.203: SW2.2 6.6,24.22 10.31,24.22 11.28,23.25 U$3.8
N$48
  Top 0.203: SW2.1 4.06,24.22 5.03,23.25 10.62,23.25 U$3.9
N$71
  Top 0.203: R46.2 19.7,18.63 19.59,18.63 19.56,18.67 LED1.C
N$72
  Top 0.203: R43.2 24.52,18.63 24.42,18.63 24.38,18.67 LED2.C
N$73
  Top 0.203: LED3.C 29.21,18.67 29.31,18.67 29.35,18.63 R42.2
N$77
  Top 1.27: 3V3INDUC.1 75.67,13.23 D2.C 79.51,15.57 83.87,15.57 84.3,15.14 88.32,15.14 88.84,15.66 U$4.2
N$78
  Top 1.27: U$5.2 88.62,26.71 88.62,25.04 87.96,24.38 85.11,24.38 84.02,25.48 84.02,26.04 83.57,26.49 78.74,26.49 77.3,25.05 D1.C 77.17,24 66.88,24 64.54,21.67 64.54,19.07 61.8,16.33 60.48,16.33 60.44,16.3 5VINDUC.1
N$79
  Top 0.61: U$6.2 88.98,7.01 88.98,8.87 87.86,9.98 79.38,9.98 77.3,7.91 D3.C
  Top 1.27: D3.C 74.8,4.1 SPOWINDUC.1
N$83
  Top 0.61: U$4.3 87.57,18.76 87.55,18.77 87.12,19.2 85.11,19.2 84.25,20.07 R44.1 R45.1
S0  (1 unrouted)
  Top 0.203: U$1.23 44.2,48.94 44.2,39.37 SV1.8 SW1.9
S1  (1 unrouted)
  Top 0.203: U$1.22 43.29,47.44 43.29,41 41.66,39.37 SV1.7 SW1.10
S2  (1 unrouted)
  Top 0.203: SW1.11 SV1.6 39.12,42.24 42.93,46.05 42.93,47.07 40.93,49.07 40.53,49.07 U$1.21
S3  (1 unrouted)
  Top 0.203: U$1.20 39.96,48.5 40.99,48.5 42.57,46.92 42.57,46.64 36.58,40.65 SV1.5 SW1.12
S4  (1 unrouted)
  Top 0.203: U$1.19 37.69,49.64 39.64,51.59 39.82,51.59 43.67,47.73 43.67,39.51 42.93,38.76 42.93,33.82 42.32,33.21 34.04,33.21 SW1.13 SV1.4
S5  (1 unrouted)
  Top 0.203: U$1.16 37.7,46.24 37.52,46.06 37.52,44.53 32.36,39.37 31.5,39.37 SV1.3 31.5,35.1 SW1.14
S6  (1 unrouted)
  Top 0.203: U$1.15 37.13,45.68 37.13,44.65 32.61,40.12 29.71,40.12 28.96,39.37 SV1.2 SW1.15
S7  (1 unrouted)
  Top 0.203: U$1.14 36.57,45.11 36.57,44.59 34.56,42.59 32.48,40.5 29.62,40.5 29.44,40.5 28.31,39.37 26.42,39.37 SV1.1 SW1.16
SCL  (3 unrouted)
  Top 0.203: 30.76,61.62 29.77,61.62 27.58,63.81 27.45,63.81 IC1.6 | 30.76,61.62 31.39,61.62 33.78,64.01 33.78,64.29 32.69,65.39 32.45,65.39 31.2,64.14 30.91,64.14 29.65,65.4 R49.2 30.4,67.66 30.8,67.66 34.29,71.14 SV27.3 | 30.76,61.62 30.76,58.83 U$1.35
SD0  (1 unrouted)
  Top 0.203: SV26.3 17.78,57.12 19.3,55.6 27.21,55.6 U$1.41
SD1  (1 unrouted)
  Top 0.203: SV26.4 17.78,54.59 17.91,54.72 26.65,54.72 26.8,54.87 U$1.42
SD2  (1 unrouted)
  Top 0.203: SV26.5 17.78,52.05 19.88,54.14 26.07,54.14 26.24,54.31 U$1.43
SD3  (1 unrouted)
  Top 0.203: U$1.44 25.67,53.74 25.11,53.18 22.26,53.18 21.98,52.89 21.17,52.89 17.78,49.51 SV26.6
SD4  (1 unrouted)
  Top 0.203: U$1.1 23,46.97 SV26.7
SDA  (via drill 0.3 pad 0.61)  (3 unrouted)
  Top 0.203: IC1.5 29.23,60.95 v30.1,60.95 30.1,60.08 30.2,59.98 30.2,58.27 U$1.36 | R1.1 30.5,66.06 31.14,66.69 31.14,67.29 36.78,72.92 SV27.2
  Bottom 0.203: SV27.2 36.83,68.23 31.94,63.34 31.39,63.34 31.39,62.23 v30.1,60.95
SERVO_0
  Top 0.305: U$2.20 38.51,15.85 39.05,15.3 47.43,15.3 JP10.1
SERVO_1
  Top 0.305: JP11.1 45.43,14.76 38.27,14.76 37.19,15.85 U$2.18
SERVO_2
  Top 0.305: JP12.1 43.35,14.31 38.07,14.31 36.53,15.85 U$2.17
SERVO_3
  Top 0.305: JP13.1 41.6,13.52 38.2,13.52 35.87,15.85 U$2.16
SERVO_4
  Top 0.305: U$2.15 35.2,14.83 JP14.1
SERVO_5
  Top 0.305: U$2.14 34.54,12.95 JP15.1
SERVO_6
  Top 0.305: U$2.13 33.88,15.84 JP16.1
SERVO_7
  Top 0.305: U$2.12 33.22,15.85 31.34,15.85 JP17.1
SPOW  (via drill 0.3, 0.3 pad 0.61)
  Top 0.152: IC2.4 76.13,39.08 76.94,38.28 76.94,35.79 75.82,34.67 71.14,34.67 70.66,34.19 v69.19,32.72
  Top 0.203: LED1.A v21.97,21.62
  Top 1.27: JP10.2 JP11.2 JP12.2 JP13.2 JP14.2 JP15.2 JP16.2 JP17.2
  Bottom 0.152: v69.19,32.72 69.37,32.54 69.37,12.32 68.73,11.68 60.1,11.68 59.14,10.73 59.14,9.65
  Bottom 0.203: JP17.2 21.97,15.37 v21.97,21.62
  Bottom 1.27: R6.P$5 59.14,9.65 JP10.2
SPOWCUR  (via drill 0.3)
  Top 0.152: IC2.3 76.13,36.1 75.34,35.31 70.71,35.31 v70.03,34.62
  Top 0.203: IC2.3 76.13,37.9 75.14,37.9 74.23,38.81 IC2.5 73.79,40.11 68.02,40.11 67.82,39.91 R2.1
  Top 0.61: U$6.3 87.68,8.56 87.38,8.87 80.75,8.87 79.5,7.62 79.5,3.73 78.26,2.49 70.36,2.49 69.42,3.43 69.42,7.11 67.6,8.93 SPOWINDUC.P$1
  Top 1.27: SPOWINDUC.P$1 66.75,8.26 61.8,8.26 C21.1
  Bottom 0.152: v70.03,34.62 70.03,10.39 68.74,9.1 SPOWINDUC.P$1
  Bottom 1.27: SPOWINDUC.P$1 67.56,9.14 63.42,9.14 63.43,9.15 R6.P$1
V_SENSE_OUT_0
  Top 0.203: R8.2 R9.1 62.52,58.56 62.47,58.51 C3.1 58.83,58.51 56.88,60.45 X1.P$1
V_SENSE_OUT_1
  Top 0.203: X1.P$3 60.12,62.99 60.46,63.33 C7.1 62.47,63.33 62.52,63.38 R19.1 R18.2
V_SENSE_OUT_2
  Top 0.203: X1.P$5 57.25,65.53 59.88,68.16 C11.1 62.85,68.16 62.9,68.21 R29.1 R28.2
V_SENSE_OUT_3
  Top 0.152: R39.1 R38.2
  Top 0.203: R39.1 62.85,72.96 62.8,72.91 C15.1 58.03,72.91 54.88,69.76 54.88,68.07 X1.P$7
V_SENSE_OUT_4
  Top 0.203: R3.2 R4.1 62.52,39.25 62.47,39.2 C1.1 58.32,39.2 57.01,40.51 X2.P$1
V_SENSE_OUT_5
  Top 0.203: X2.P$3 57.01,43.05 57.99,44.03 C5.1 62.47,44.03 62.52,44.08 R14.1 R13.2
V_SENSE_OUT_6
  Top 0.203: X2.P$5 56.49,45.59 59.76,48.86 C9.1 62.47,48.86 62.52,48.91 R24.1 R23.2
V_SENSE_OUT_7
  Top 0.203: X2.P$7 54.24,48.13 54.24,49.83 58.09,53.68 C13.1 62.47,53.68 62.52,53.73 R34.1 63.75,53.41 64.61,53.41 64.93,53.73 R33.2
VDD  (via drill 0.3, 0.3 pad 0.61)  (9 unrouted)
  Top 0.152: 76.13,49.49 75.13,50.39 v64.67,50.39
  Top 0.203: IC6.4 76.13,49.49
  Top 0.305: 18.66,62.78 18.41,62.78 17.83,62.2 SV26.1 | 18.66,62.78 19,62.78 C27.2 20.2,62.23 24.75,62.23 | 18.66,62.78 R47.1 R48.1 | 24.75,62.23 24.75,62.93 IC1.8 26.64,64.82 | 24.75,62.23 24.75,58.16 C25.1 25.95,56.95 26.45,56.45 26.55,56.35 27.59,56.35 U$1.40 29.67,54.27 29.8,54.14 v30.04,54.14 | U$1.8 29.49,45.53 v28.83,45.53 28.83,45.33 28.8,45.3 C24.1 | v36.72,49.27 36.94,49.27 U$1.18 40.09,46.11 40.33,46.11 C17.1 | 27.53,64.82 29.06,63.29 31.7,63.29 R1.2 | 26.64,64.82 | 26.64,64.82 27.53,64.82 | 27.53,64.82 27.53,67.47 R49.1 31.15,71.09 31.75,71.09 SV27.4 | JP27.6 42.94,2.05 37.83,2.05 JP27.3 34.35,1.08 23.56,1.08 JP26.6 20.08,2.05 14.97,2.05 JP26.3 | U$2.2 37.85,21.69 31.93,21.69 31.09,22.53 26.19,22.53 25.29,21.62 LED2.A 23.48,21.62 22.57,20.72 v21.34,20.72 16.21,20.72 15.24,21.69 U$3.2 | U$1.30 v34.52,55.09
  Bottom 0.203: v64.67,50.39 62.61,48.39 62.59,19.76 62.58,19.77 R26.P$5
  Bottom 0.305: R26.P$5 62.58,18.23 59.71,18.23 54.97,13.49 50.09,13.49 49.28,12.68 49.28,6.53 46.05,3.3 JP27.6 | 32.23,49.27 28.83,45.86 v28.83,45.53 27.69,44.39 27.69,28.24 21.34,21.89 v21.34,20.72 JP26.6 | 32.23,49.27 32.23,54.08 | v36.72,49.27 32.23,49.27 | 32.23,54.08 30.1,54.08 v30.04,54.14 | 32.23,54.08 32.74,54.08 | 32.74,54.08 33.08,54.08 | v34.52,55.09 33.51,54.08 32.74,54.08

### Text on the board
tPlace: SDA | 3V3 | GND | + | - | I2C | Analog | 5V | GND | SCL | IMU | GND | 5V | RX | TX | 5V | GND | GROUND | SIG | A0 | A1 | A2 | A3 | GROUND | Analog | SIG | 5V | GND | A7 | A6 | A5 | A4 | P5 | P6 | P7 | P8 | P9 | P10 | P11 | P12 | P13 | P14 | P15 | P16 | P17 | P18 | P19 | P20 | X | + | - | - | 5V | - | Z | Y | - | GROUND | Ser | 3V3 | 5V | 3V3 | IND$3 | IND$2 | 7-22V | 1 | 2 | 3 | 4 | 1 | 2 | 3 | 4 | 1 | 2 | 3 | 4 | 5 | 6 | 7 | 8 | + | SIG | 5V | ESC | Servos | SERVOS | Unused | GND | IND$1 | 5V | G | 3V3 | 5V | G | 3V3 | 5V | G | 3V3 | 5V | G | 3V3 | www.anzhelka.com
bPlace: Designed by: | SLRM | ILukester | 3/1/12 | REV: A | C:/Users/lderuyter/Documents/eagle/QuadPower/tribal_phoenix2.bmp